# EasyEDA Pro project 学期项目.epro, board PCB2
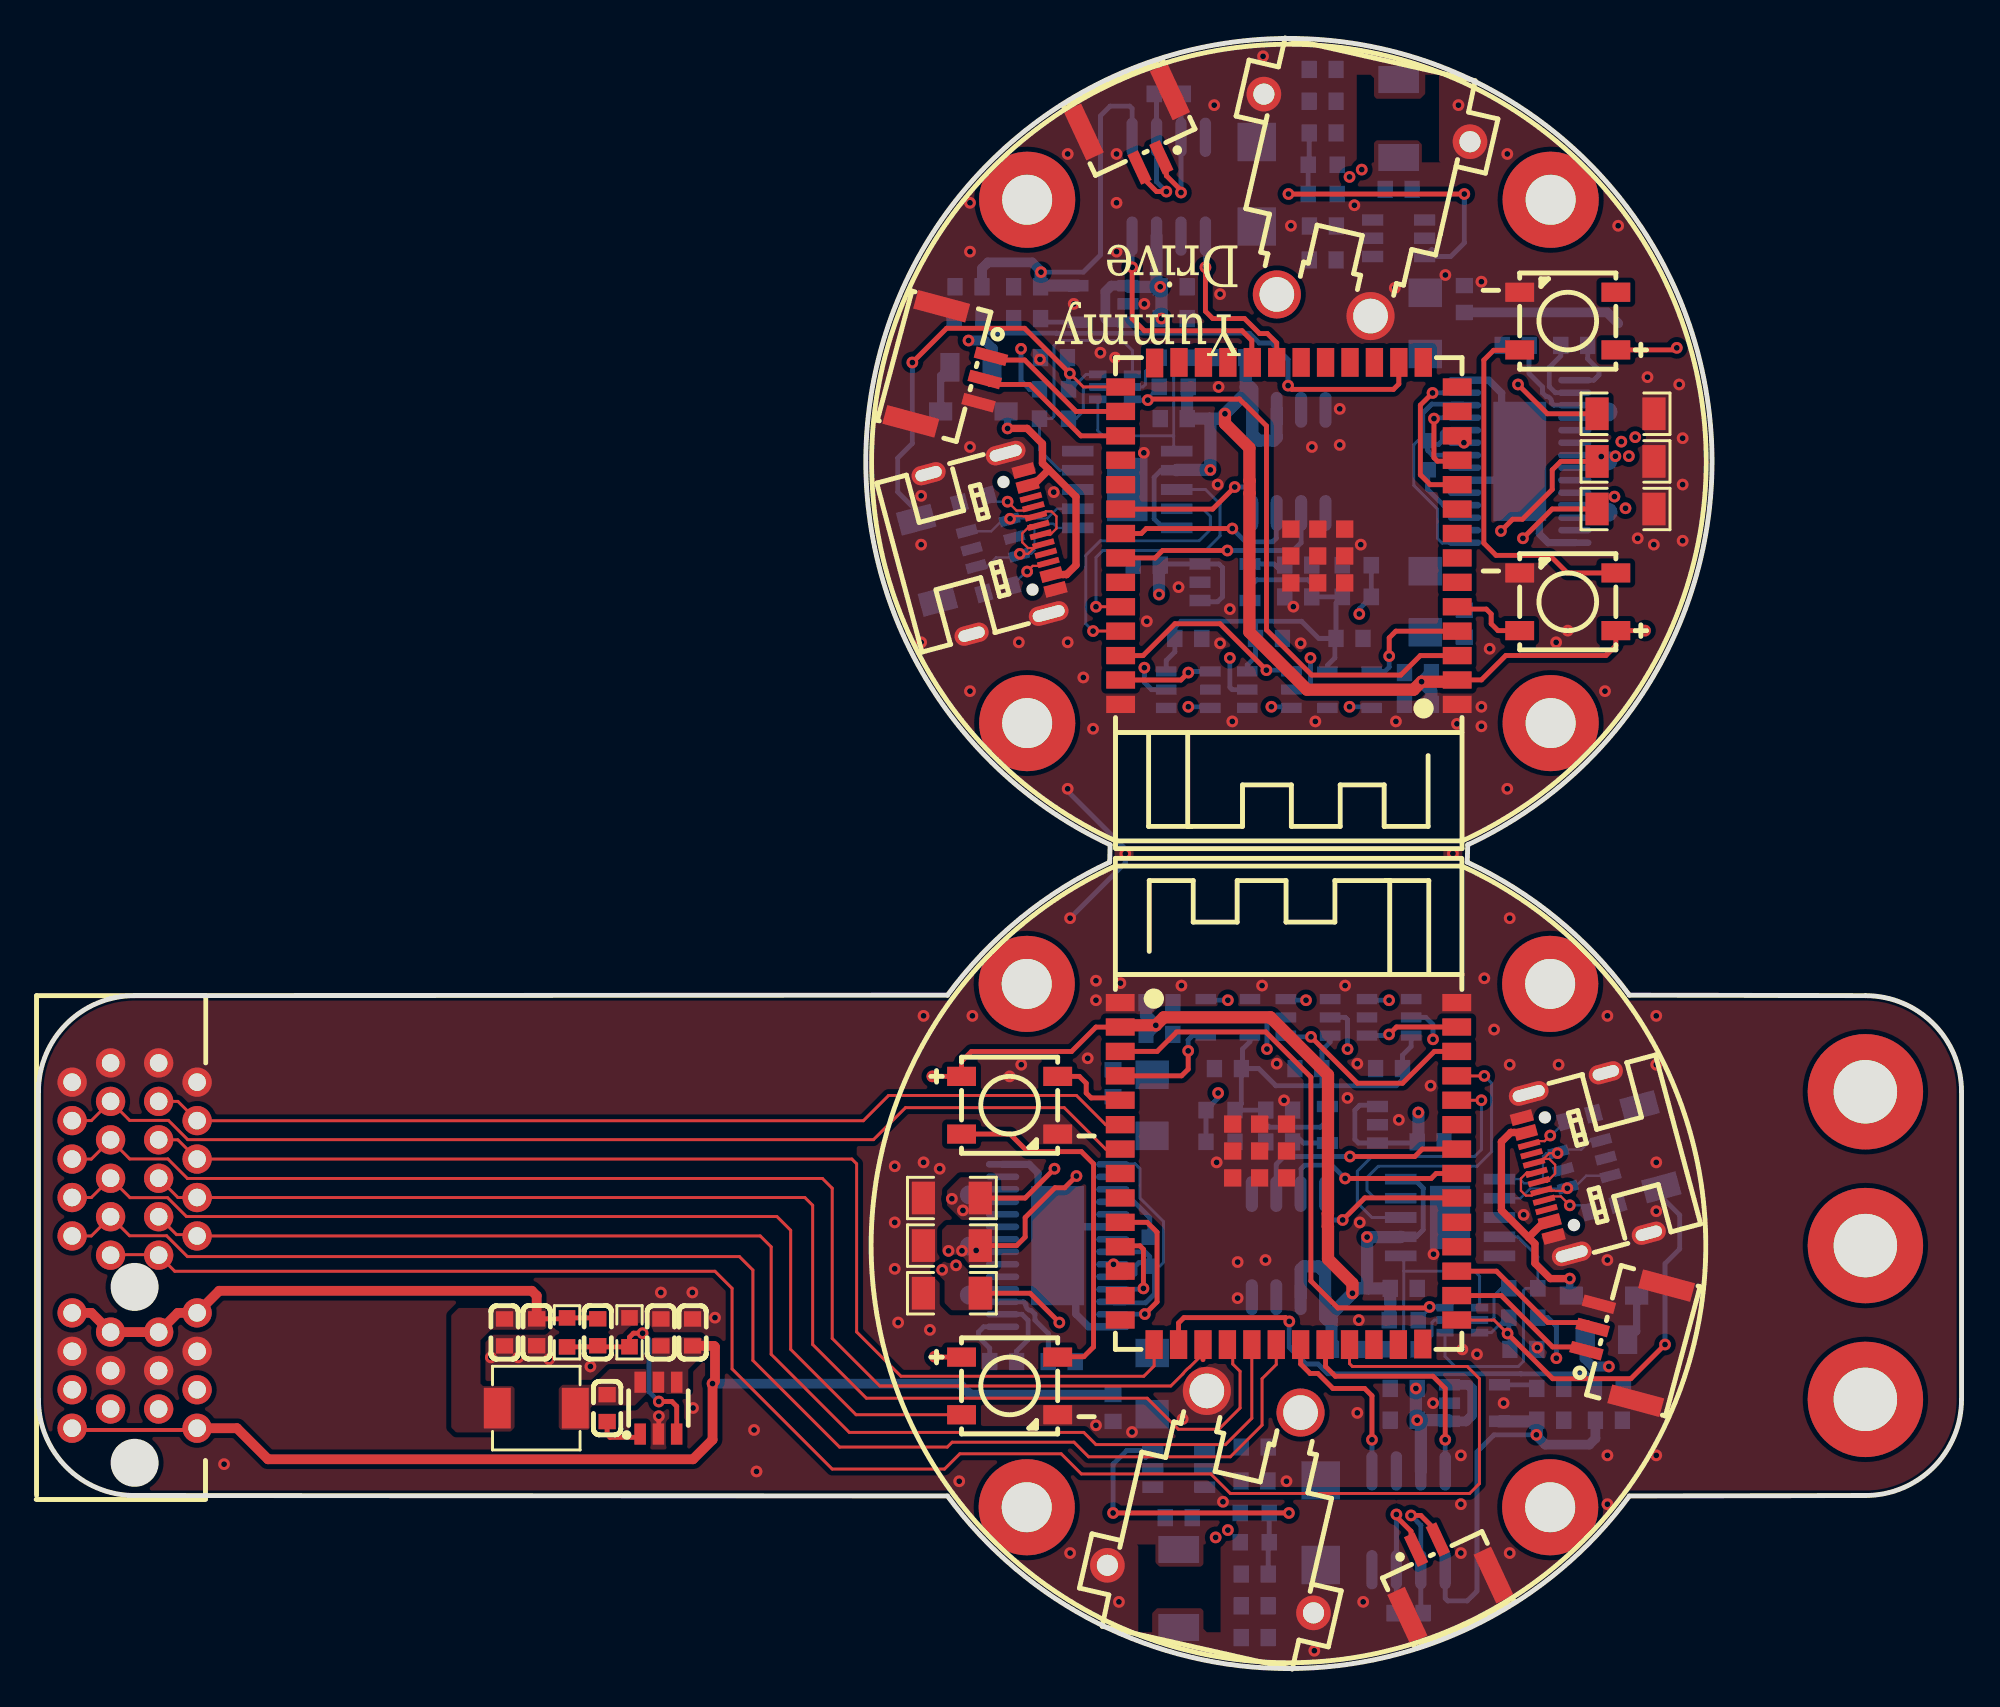
[diagram p17: board, top side]
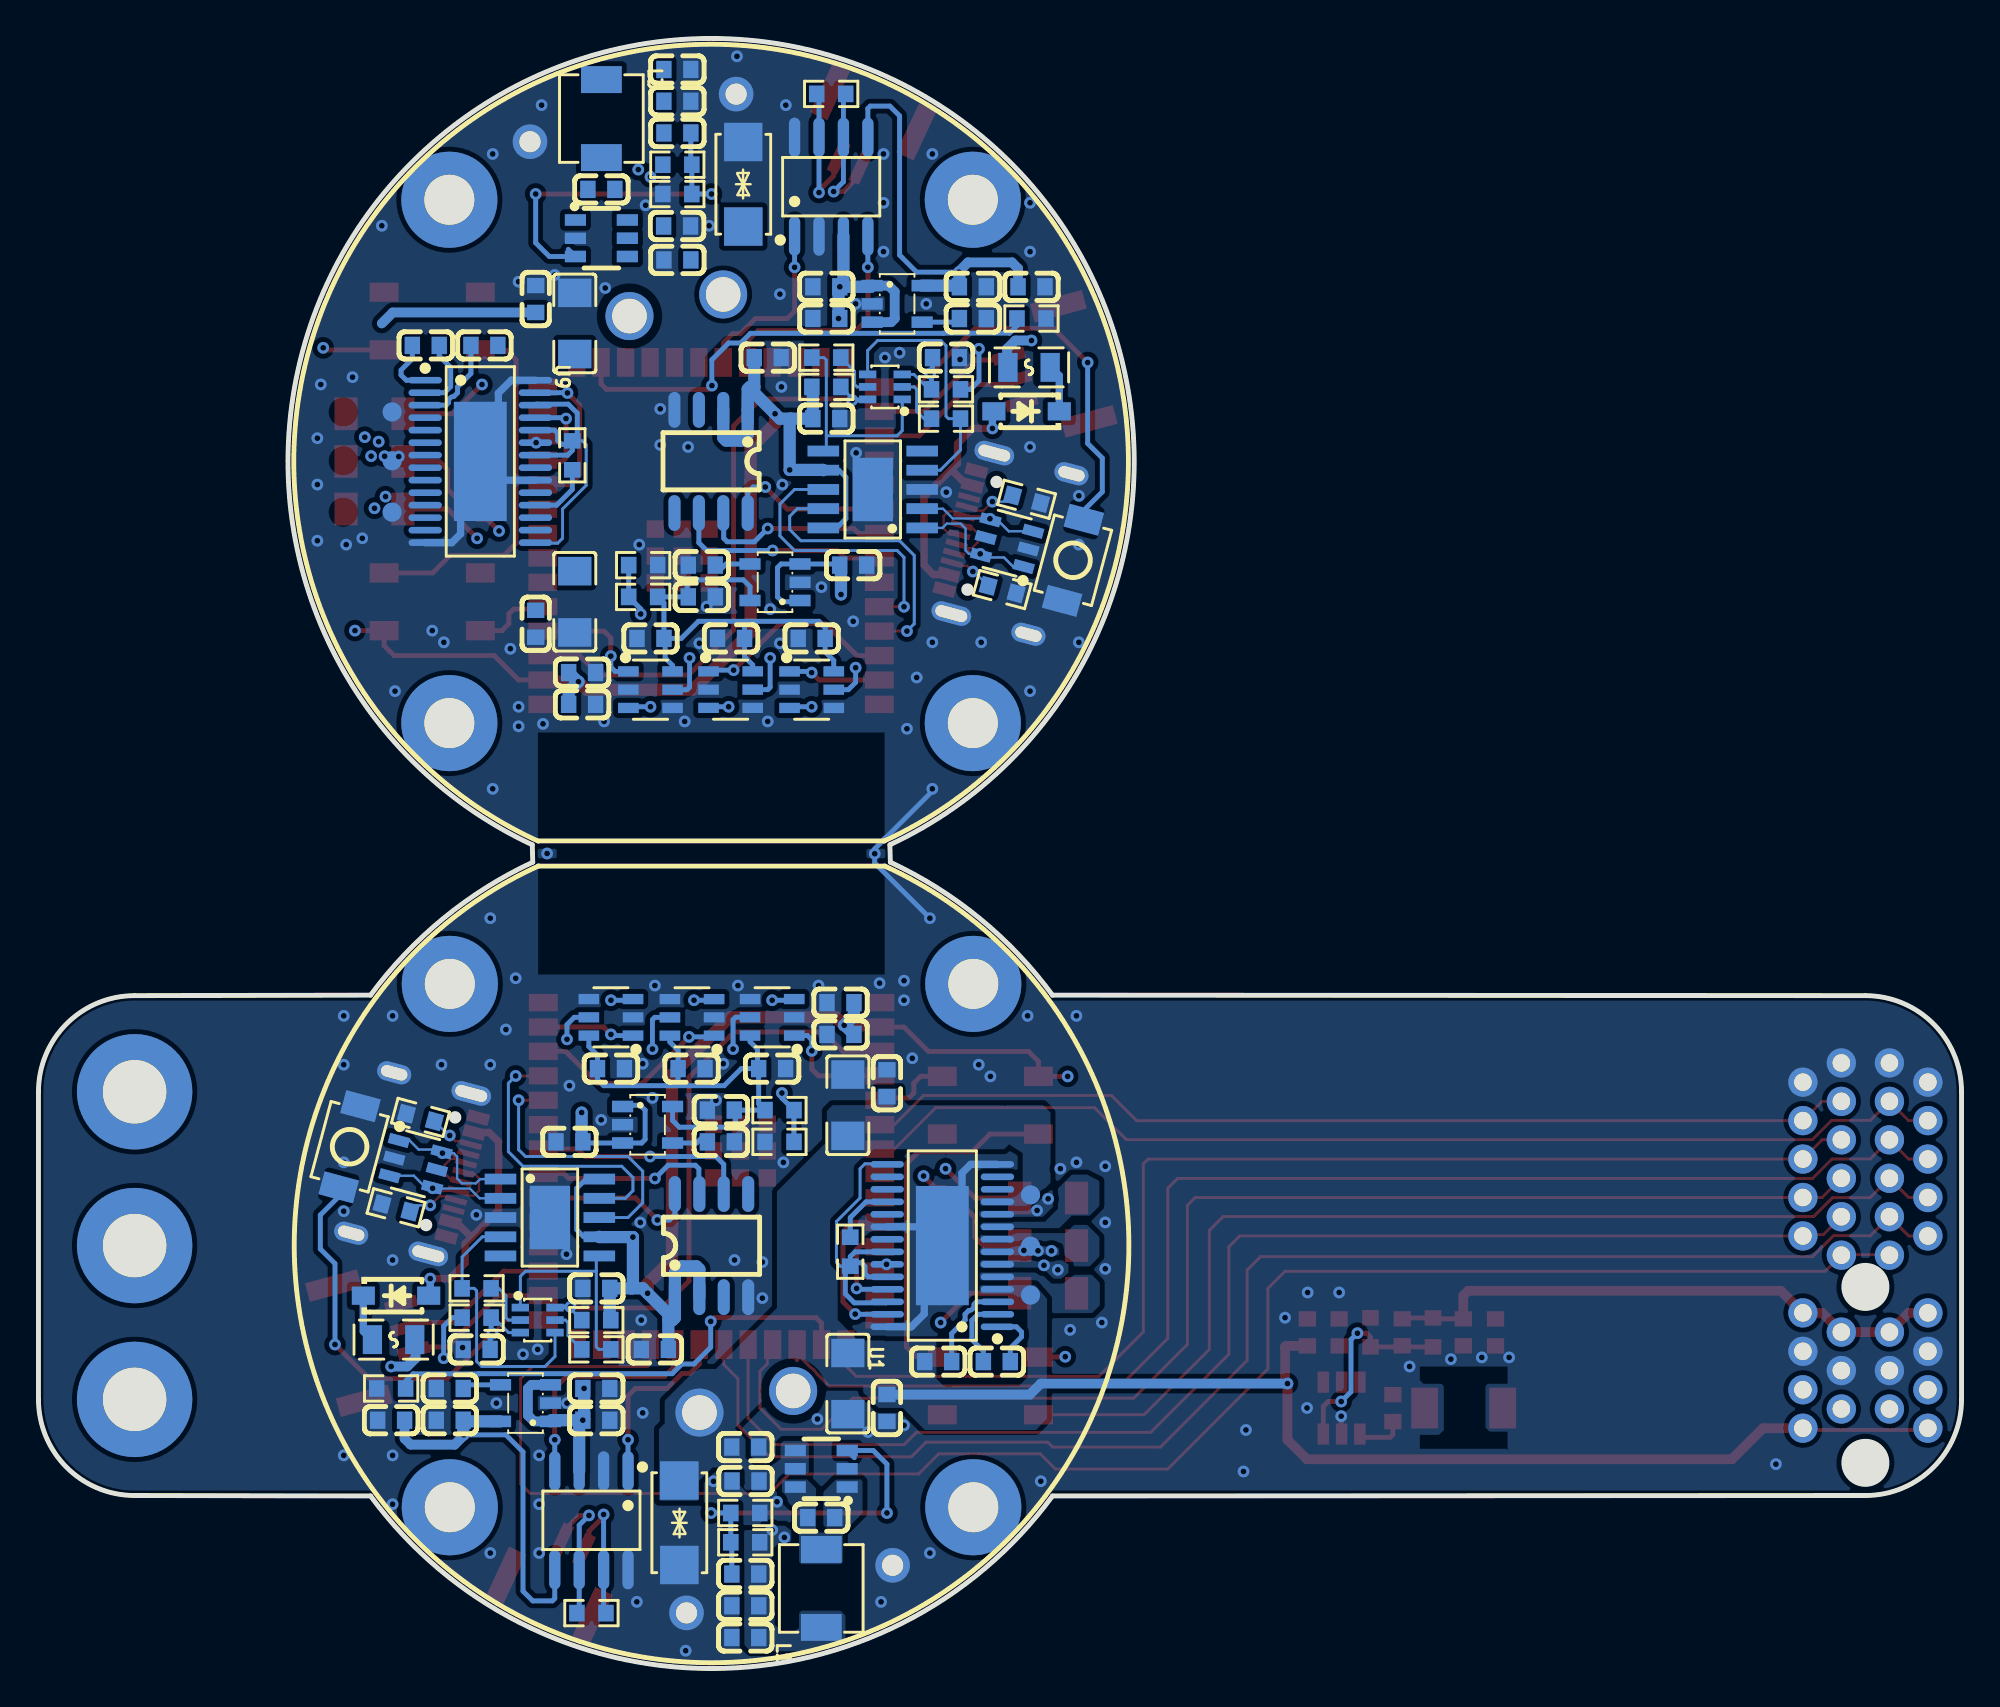
[diagram p18: board, bottom side, seen from below]

Outline 100 x 84.79 mm; copper layers: Top Layer, Inner1, Inner2, Bottom Layer. Coordinates in mm from the lower left corner of the outline.
Outline path: 0,30 arc(1.46,33.54) 5,35 47.27,35.02 arc(51.05,39.01) 55.7,41.94 55.73,42.85 arc(65.02,84.79) 74.32,42.85 74.3,41.94 arc(78.95,39.01) 82.73,35.02 95,35 arc(98.54,33.54) 100,30 100,14 arc(98.54,10.46) 95,9 82.73,8.98 arc(65,0) 47.27,8.98 5,9 arc(1.46,10.46) 0,14 0,30
Stack: Top Layer 0.035mm Outer layer thickness 1oz / Dielectric1 0.2104mm 7628 RC49% 8.6mil / Inner1 0.0152mm Inner layer thickness / Dielectric2 1.065mm 1.1mm H/HOZ Copper / Inner2 0.0152mm Inner layer thickness / Dielectric3 0.2104mm 7628 RC49% 8.6mil / Bottom Layer 0.035mm Outer layer thickness 1oz

## Design rules (mm)
net CANH: DP1
net CANL: DP1
net CH340_D+: DP2
net CH340_D-: DP2
spacing copperThickness1oz (default): track to track 0.102, other pairs 0.152 to 0.3
spacing copperThickness2oz: track to track 0.203, other pairs 0.152 to 0.3
track width copperThickness1oz (default): min 0.102, default 0.254, max 2.54
track width copperThickness2oz: min 0.203, default 0.254, max 2.54
differential pair differentialPair (default): width min 0.102, default 0.254, max 2.54; gap min 0.152, default 0.152
net GND uses copperRegion
net +5V uses copperRegion

## Placement (name value [footprint] x y rotation side)
C1  100nF  [C0603]  24.24 17.48 90 top
C2  100nF  [C0603]  29.57 13.55 270 top
C3  10uF  [C0603]  63.25 3.27 180 bottom
C4  10nF  [C0603]  79.86 68.82 0 bottom
C5  22uF  [C0603]  63.25 11.52 0 bottom
C6  10uF  [C0603]  70.99 12.92 180 bottom
C7  100nF  [C0603]  55.88 13.55 270 bottom
C8  100uF  [C1206]  57.91 29.3 270 bottom
C9  100nF  [C0603]  67.94 16.6 0 bottom
C10  1uF  [C0603]  72.39 27.4 180 bottom
C11  100uF  [C1206]  57.91 14.82 90 bottom
C12  100nF  [C0603]  55.88 30.44 270 bottom
C13  100nF  [C0603]  53.21 15.97 180 bottom
C14  10nF  [C0603]  50.16 15.97 180 bottom
C15  100nF  [C0603]  70.23 31.21 0 bottom
C16  100nF  [C0603]  66.04 31.21 0 bottom
C17  100nF  [C0603]  61.85 31.21 0 bottom
C18  100pF  [C0603]  29.08 17.49 90 top
C19  100nF  [C0603]  70.99 14.57 180 bottom
C20  100nF  [C0603]  63.25 1.61 180 bottom
C21  100nF  [C0603]  59.3 7.85 180 bottom
C22  100pF  [C0603]  63.25 4.92 180 bottom
C23  100nF  [C0603]  63.23 9.76 180 bottom
C24  100nF  [C0603]  64.52 29.05 180 bottom
C25  100nF  [C0603]  76.81 68.82 0 bottom
C26  100nF  [C0603]  64.52 27.4 0 bottom
C27  100nF  [C0603]  32.36 17.48 270 top
C28  10uF  [C0603]  25.91 17.49 90 top
C29  22uF  [C0603]  34.02 17.48 270 top
C30  100nF  [C0603]  74.14 71.23 90 bottom
C31  100nF  [C0603]  74.14 54.34 90 bottom
C32  10uF  [C0603]  71.73 50.15 180 bottom
C33  100nF  [C0603]  71.73 51.8 180 bottom
C34  100uF  [C1206]  72.11 55.49 90 bottom
C35  100uF  [C1206]  72.11 69.96 270 bottom
C36  10uF  [C0603]  58.29 34.63 0 bottom
C37  100nF  [C0603]  58.29 32.98 0 bottom
C38  1uF  [C0603]  77.22 16.6 0 bottom
C39  100nF  [C0603]  78.61 12.92 180 bottom
C40  100nF  [C0603]  81.66 12.92 180 bottom
C41  100nF  [C0603]  70.99 19.78 180 bottom
C42  100nF  [C0603]  70.73 76.94 0 bottom
C43  100nF  [C0603]  78.61 14.57 180 bottom
C44  100nF  [C0603]  68.18 53.58 180 bottom
C45  100nF  [C0603]  66.79 75.03 0 bottom
C46  10uF  [C0603]  66.78 81.52 0 bottom
C47  100pF  [C0603]  66.78 79.87 0 bottom
C48  100nF  [C0603]  66.78 83.17 0 bottom
C49  22uF  [C0603]  66.78 73.27 180 bottom
C50  -  [C0603]  65.51 57.39 180 bottom
C51  -  [C0603]  65.51 55.74 0 bottom
C52  100nF  [C0603]  63.98 53.58 180 bottom
C53  100nF  [C0603]  62.08 68.19 180 bottom
C54  100nF  [C0603]  59.79 53.58 180 bottom
C55  100nF  [C0603]  59.03 65.01 0 bottom
C56  10uF  [C0603]  59.03 71.87 0 bottom
C57  100nF  [C0603]  59.03 70.22 0 bottom
C58  1uF  [C0603]  57.63 57.39 0 bottom
C59  1uF  [C0603]  52.81 68.19 180 bottom
C60  -  [C0603]  51.41 70.22 0 bottom
C61  100nF  [C0603]  51.41 71.87 0 bottom
C62  -  [C0603]  48.36 71.87 0 bottom
CN1  WAFER-GH1.25-3PWB  [CONN-TH_3P-P1.25_GH1.25]  82.34 17.33 75 top
CN2  XT30PW-M30.G.Y  [CONN-TH_XT30PW-M]  62.07 9 347 top
CN3  WAFER-GH1.25-2PWB  [CONN-TH_2P-P1.25_XUNPU_WAFER-GH1.25-2PWB]  72.81 5.13 25 top
CN4  3183-10110P1T  [CONN-TH_36P-P1.00-V_3183-XXXXXPXT]  5 22 270 top
CN5  XT30PW-M30.G.Y  [CONN-TH_XT30PW-M]  67.96 75.78 167 top
CN6  WAFER-GH1.25-2PWB  [CONN-TH_2P-P1.25_XUNPU_WAFER-GH1.25-2PWB]  57.21 79.65 205 top
CN7  WAFER-GH1.25-3PWB  [CONN-TH_3P-P1.25_GH1.25]  47.69 67.46 255 top
D1  SMAJ40CA  [SMA_L4.3-W2.6-LS5.0-BI]  66.68 7.58 90 bottom
D2  USBLC6-2SC6  [SOT-23-6_L2.9-W1.6-P0.95-LS2.8-BL]  80.39 26.25 285 bottom
D3  B5819W SL  [SOD-123_L2.7-W1.6-LS3.7-RD-1]  81.41 19.39 180 bottom
D4  SMAJ40CA  [SMA_L4.3-W2.6-LS5.0-BI]  63.35 77.2 270 bottom
D5  USBLC6-2SC6  [SOT-23-6_L2.9-W1.6-P0.95-LS2.8-BL]  49.63 58.53 105 bottom
D6  B5819W SL  [SOD-123_L2.7-W1.6-LS3.7-RD-1]  48.62 65.39 0 bottom
F1  JK-SMD0805-100  [F0805]  81.53 17.11 180 bottom
F2  JK-SMD0805-100  [F0805]  48.49 67.68 0 bottom
L1  10uH  [IND-SMD_L4.4-W4.2]  59.3 4.17 90 bottom
L2  10uH  [IND-SMD_L4.4-W4.2]  25.89 13.55 0 top
L3  10uH  [IND-SMD_L4.4-W4.2]  70.73 80.62 270 bottom
LED1  XL-5050RGBC-WS2812B  [LED-SMD_4P-L5.0-W5.0-BL_XL-5050RGBC]  50.5 14.7 270 top
LED2  XL-5050RGBC-WS2812B  [LED-SMD_4P-L5.0-W5.0-BL_XL-5050RGBC]  50.5 29.3 270 top
LED3  XL-5050RGBC-WS2812B  [LED-SMD_4P-L5.0-W5.0-BL_XL-5050RGBC]  79.52 55.49 90 top
LED4  XL-5050RGBC-WS2812B  [LED-SMD_4P-L5.0-W5.0-BL_XL-5050RGBC]  79.52 70.09 90 top
MARK1  -  [Mark-Point-1mm]  45.87 19.42 180 bottom
MARK2  -  [Mark-Point-1mm]  45.87 21.97 180 bottom
MARK3  -  [Mark-Point-1mm]  45.87 24.64 180 bottom
MARK4  -  [Mark-Point-1mm]  84.15 62.82 0 bottom
MARK5  -  [Mark-Point-1mm]  84.15 60.15 0 bottom
MARK6  -  [Mark-Point-1mm]  84.15 65.36 0 bottom
NOREF  -  [Pad_e237]  51.39 35.61 0 top
NOREF#2  -  [Pad_e239]  51.39 8.39 0 top
NOREF#3  -  [Pad_e1785]  51.41 49.18 180 top
NOREF#4  -  [Pad_e813]  95 30 0 top
NOREF#5  -  [Pad_e240]  78.61 8.39 0 top
NOREF#6  -  [Pad_e1784]  78.63 76.4 180 top
NOREF#7  -  [Pad_e1786]  51.41 76.4 180 top
NOREF#8  -  [Pad_e815]  95 14 0 top
NOREF#9  -  [Pad_e1783]  78.63 49.18 180 top
NOREF#10  -  [Pad_e238]  78.61 35.61 0 top
NOREF#11  -  [Pad_e814]  95 22 0 top
Q1  LMBT3904DW1T1G  [SOT-363_L2.0-W1.3-P0.65-LS2.1-BR]  55.98 66.66 180 bottom
Q2  LMBT3904DW1T1G  [SOT-363_L2.0-W1.3-P0.65-LS2.1-BR]  74.04 18.12 0 bottom
R1  120  [R0603]  71.25 2.88 180 bottom
R2  10K  [R0603]  57.78 21.68 270 bottom
R3  1K  [R0603]  61.47 29.05 0 bottom
R4  1K  [R0603]  61.47 27.4 180 bottom
R5  22K  [R0603]  63.25 6.57 180 bottom
R6  3K  [R0603]  63.25 8.09 0 bottom
R7  50mΩ  [R1206]  47.5 24.47 180 top
R8  50mΩ  [R1206]  47.5 22 180 top
R9  50mΩ  [R1206]  47.5 19.52 180 top
R10  5.1K  [R0603]  81.41 23.97 195 bottom
R11  5.1K  [R0603]  80.14 28.67 195 bottom
R12  43K  [R0603]  27.49 17.48 90 top
R13  10K  [R0603]  30.73 17.49 270 top
R14  10K  [R0603]  72.24 63.11 90 bottom
R15  1K  [R0603]  68.56 55.74 180 bottom
R16  1K  [R0603]  68.56 57.39 0 bottom
R17  10kΩ  [R0603]  77.22 18.25 180 bottom
R18  10kΩ  [R0603]  70.99 18.12 0 bottom
R19  10kΩ  [R0603]  81.66 14.57 180 bottom
R20  3K  [R0603]  66.78 76.69 180 bottom
R21  22K  [R0603]  66.78 78.22 0 bottom
R22  10kΩ  [R0603]  77.22 19.78 0 bottom
R23  10kΩ  [R0603]  70.99 16.6 180 bottom
R24  10kΩ  [R0603]  59.03 68.19 0 bottom
R25  10kΩ  [R0603]  59.03 66.66 180 bottom
R26  120  [R0603]  58.78 81.9 0 bottom
R27  10kΩ  [R0603]  52.81 66.53 0 bottom
R28  10kΩ  [R0603]  52.81 65.01 180 bottom
R29  5.1K  [R0603]  49.89 56.12 15 bottom
R30  5.1K  [R0603]  48.62 60.82 15 bottom
R31  10kΩ  [R0603]  48.36 70.22 0 bottom
R32  50mΩ  [R1206]  82.53 60.31 0 top
R33  50mΩ  [R1206]  82.53 65.26 0 top
R34  50mΩ  [R1206]  82.53 62.79 0 top
SW1  TS-1088-AR02016  [SW-SMD_L3.9-W3.0-P4.45]  46.2 57.64 285 bottom
SW6  TS-1088-AR02016  [SW-SMD_L3.9-W3.0-P4.45]  83.82 27.14 105 bottom
U1  DRV8313PWPR  [HTSSOP-28_L9.8-W4.5-P0.65-LS6.6-BL-EP]  53 22 90 bottom
U2  INA181A2IDBVR  [SOT-23-6_L2.9-W1.6-P0.95-LS2.8-BL]  70.23 33.87 90 bottom
U3  INA181A2IDBVR  [SOT-23-6_L2.9-W1.6-P0.95-LS2.8-BL]  66.02 33.87 90 bottom
U4  INA181A2IDBVR  [SOT-23-6_L2.9-W1.6-P0.95-LS2.8-BL]  61.85 33.87 90 bottom
U5  TJA1051T/3/1J  [SOIC-8_L4.9-W3.9-P1.27-LS6.0-BL]  71.25 7.71 0 bottom
U6  RS3236-3.3AYF5  [SOT-23-5_L3.0-W1.7-P0.95-LS2.8-BR]  68.33 28.28 0 bottom
U7  ME3121AM6G  [SOT-23-6_L2.9-W1.6-P0.95-LS2.8-BR]  59.3 10.39 180 bottom
U8  ME3121AM6G  [SOT-23-6_L2.9-W1.6-P0.95-LS2.8-BR]  32.24 13.55 270 top
U9  DRV8313PWPR  [HTSSOP-28_L9.8-W4.5-P0.65-LS6.6-BL-EP]  77.02 62.79 270 bottom
U10  MT6701CT-STD  [SOP-8_L4.9-W3.9-P1.27-LS6.0-BL]  65 22 180 bottom
U11  ME3121AM6G  [SOT-23-6_L2.9-W1.6-P0.95-LS2.8-BR]  70.73 74.4 0 bottom
U12  INA181A2IDBVR  [SOT-23-6_L2.9-W1.6-P0.95-LS2.8-BL]  68.18 50.91 270 bottom
U13  MT6701CT-STD  [SOP-8_L4.9-W3.9-P1.27-LS6.0-BL]  65.02 62.79 0 bottom
U14  INA181A2IDBVR  [SOT-23-6_L2.9-W1.6-P0.95-LS2.8-BL]  64.01 50.92 270 bottom
U15  RS3236-3.3AYF5  [SOT-23-5_L3.0-W1.7-P0.95-LS2.8-BR]  61.7 56.5 180 bottom
U16  INA181A2IDBVR  [SOT-23-6_L2.9-W1.6-P0.95-LS2.8-BL]  59.79 50.91 270 bottom
U17  TJA1051T/3/1J  [SOIC-8_L4.9-W3.9-P1.27-LS6.0-BL]  58.78 77.08 180 bottom
U18  CH340K  [ESOP-10_L4.9-W3.9-P1.00-LS6.0-BL-EP]  56.62 61.33 90 bottom
U19  RS3236-3.3AYF5  [SOT-23-5_L3.0-W1.7-P0.95-LS2.8-BR]  74.67 13.81 180 bottom
U20  RS3236-3.3AYF5  [SOT-23-5_L3.0-W1.7-P0.95-LS2.8-BR]  55.35 70.98 0 bottom
U21  ESP32-S3-WROOM-1-N16R8  [WIRELM-SMD_ESP32-S3-WROOM-1]  65 25.74 0 top
U22  CH340K  [ESOP-10_L4.9-W3.9-P1.00-LS6.0-BL-EP]  73.41 23.46 270 bottom
U23  ESP32-S3-WROOM-1-N16R8  [WIRELM-SMD_ESP32-S3-WROOM-1]  65.02 59.04 180 top
USB1  TYPEC-304-ACP16  [USB-C-SMD_TYPE-C-16P-1_1]  49.73 58.6 285 top
USB2  TYPEC-304-ACP16  [USB-C-SMD_TYPE-C-16P-1_1]  80.29 26.19 105 top

## Footprints (pads in the part's own frame, mm; a bottom-side part is the same pattern mirrored in y, then rotated)
C0603
  rect 0.8x0.9 smd: 1(-0.7,0) 2(0.7,0)
C1206
  rect 1.485x1.728 smd: 1(-1.593,0) 2(1.593,0)
CONN-TH_2P-P1.25_XUNPU_WAFER-GH1.25-2PWB
  rect 0.6x1.7 smd: 1(-0.625,1.45) 2(0.625,1.45)
  rect 1x2.8 smd: 3(-2.475,-1.45) 4(2.475,-1.45)
CONN-TH_3P-P1.25_GH1.25
  rect 0.6x1.7 smd: 1(-1.25,1.575) 2(0,1.575) 3(1.25,1.575)
  rect 1x2.8 smd: 4(3.1,-1.575) 5(-3.1,-1.575)
CONN-TH_36P-P1.00-V_3183-XXXXXPXT
  round 1.524 hole 0.914: A1(-9.5,1.25) A2(-8.5,3.25) A3(-7.5,1.25) A4(-6.5,3.25) A5(-5.5,1.25) A6(-4.5,3.25) A7(-3.5,1.25) A8(-2.5,3.25) A9(-1.5,1.25) A10(-0.5,3.25) A11(0.5,1.25) A12(3.5,3.25) A13(4.5,1.25) A14(5.5,3.25) A15(6.5,1.25) A16(7.5,3.25) A17(8.5,1.25) A18(9.5,3.25) B1(-9.5,-1.25) B2(-8.5,-3.25) B3(-7.5,-1.25) B4(-6.5,-3.25) B5(-5.5,-1.25) B6(-4.5,-3.25) B7(-3.5,-1.25) B8(-2.5,-3.25) B9(-1.5,-1.25) B10(-0.5,-3.25) B11(0.5,-1.25) B12(3.5,-3.25) B13(4.5,-1.25) B14(5.5,-3.25) B15(6.5,-1.25) B16(7.5,-3.25) B17(8.5,-1.25) B18(9.5,-3.25)
CONN-TH_XT30PW-M
  round 2.5 hole 1.8: 1(-2.5,5) 2(2.5,5)
  round 1.8 hole 1.1: 3(5.5,-5) 4(-5.5,-5)
ESOP-10_L4.9-W3.9-P1.00-LS6.0-BL-EP
  rect 0.56x1.64 smd: 1(-2,-2.57) 2(-1,-2.57) 3(0,-2.57) 4(1,-2.57) 5(2,-2.57) 6(2,2.57) 7(1,2.57) 8(0,2.57) 9(-1,2.57) 10(-2,2.57)
  rect 3.3x2.1 smd: 11(0,0)
F0805
  rect 1x1.5 smd: 1(-1.1,0) 2(1.1,0)
HTSSOP-28_L9.8-W4.5-P0.65-LS6.6-BL-EP
  oval 0.343x1.732 smd: 1(-4.225,-2.866) 2(-3.575,-2.866) 3(-2.925,-2.866) 4(-2.275,-2.866) 5(-1.625,-2.866) 6(-0.975,-2.866) 7(-0.325,-2.866) 8(0.325,-2.866) 9(0.975,-2.866) 10(1.625,-2.866) 11(2.275,-2.866) 12(2.925,-2.866) 13(3.575,-2.866) 14(4.225,-2.866) 15(4.225,2.866) 16(3.575,2.866) 17(2.925,2.866) 18(2.275,2.866) 19(1.625,2.866) 20(0.975,2.866) 21(0.325,2.866) 22(-0.325,2.866) 23(-0.975,2.866) 24(-1.625,2.866) 25(-2.275,2.866) 26(-2.925,2.866) 27(-3.575,2.866) 28(-4.225,2.866)
  rect 6.2x2.75 smd: 29(0,0)
IND-SMD_L4.4-W4.2
  rect 1.4x2.12 smd: 1(2.028,0) 2(-2.028,0)
LED-SMD_4P-L5.0-W5.0-BL_XL-5050RGBC
  rect 1x1.5 smd: 1(-1.5,-2.5) 2(1.5,-2.5) 3(1.5,2.5) 4(-1.5,2.5)
Mark-Point-1mm
  round 1 smd: 1(-2.54,0)
Pad_e237
  round 5 hole 2.6: 1(0,0)
Pad_e238
  round 5 hole 2.6: 1(0,0)
Pad_e239
  round 5 hole 2.6: 1(0,0)
Pad_e240
  round 5 hole 2.6: 1(0,0)
Pad_e813
  round 6 hole 3.3: 1(0,0)
Pad_e814
  round 6 hole 3.3: 1(0,0)
Pad_e815
  round 6 hole 3.3: 1(0,0)
Pad_e1783
  round 5 hole 2.6: 1(0,0)
Pad_e1784
  round 5 hole 2.6: 1(0,0)
Pad_e1785
  round 5 hole 2.6: 1(0,0)
Pad_e1786
  round 5 hole 2.6: 1(0,0)
R0603
  rect 0.806x0.864 smd: 1(-0.753,0) 2(0.753,0)
R1206
  rect 1.208x1.701 smd: 1(-1.479,0) 2(1.479,0)
SMA_L4.3-W2.6-LS5.0-BI
  rect 2x2 smd: 1(-2.2,0) 2(2.2,0)
SOD-123_L2.7-W1.6-LS3.7-RD-1
  rect 1.2x0.95 smd: 1(-1.7,0) 2(1.7,0)
SOIC-8_L4.9-W3.9-P1.27-LS6.0-BL
  oval 0.588x2.045 smd: 1(-1.905,-2.57) 2(-0.635,-2.57) 3(0.635,-2.57) 4(1.905,-2.57) 5(1.905,2.57) 6(0.635,2.57) 7(-0.635,2.57) 8(-1.905,2.57)
SOP-8_L4.9-W3.9-P1.27-LS6.0-BL
  oval 0.63x1.865 smd: 1(-1.905,-2.683) 2(-0.635,-2.683) 3(0.635,-2.683) 4(1.905,-2.683) 5(1.905,2.683) 6(0.635,2.683) 7(-0.635,2.683) 8(-1.905,2.683)
SOT-23-5_L3.0-W1.7-P0.95-LS2.8-BR
  rect 1.1x0.6 smd: 1(1.3,-0.95) 2(1.3,0) 3(1.3,0.95) 4(-1.3,0.95) 5(-1.3,-0.95)
SOT-23-6_L2.9-W1.6-P0.95-LS2.8-BL
  rect 0.532x1.072 smd: 1(-0.95,-1.149) 2(0,-1.149) 3(0.95,-1.149) 4(0.95,1.149) 5(0,1.149) 6(-0.95,1.149)
SOT-23-6_L2.9-W1.6-P0.95-LS2.8-BR
  rect 1.1x0.6 smd: 1(1.35,-0.95) 2(1.35,0) 3(1.35,0.95) 4(-1.35,0.95) 5(-1.35,0) 6(-1.35,-0.95)
SOT-363_L2.0-W1.3-P0.65-LS2.1-BR
  rect 0.9x0.4 smd: 1(0.9,-0.65) 2(0.9,0) 3(0.9,0.65) 4(-0.9,0.65) 5(-0.9,0) 6(-0.9,-0.65)
SW-SMD_L3.9-W3.0-P4.45
  rect 1.23x1.86 smd: 1(-2.185,0) 2(2.185,0)
USB-C-SMD_TYPE-C-16P-1_1
  rect 0.6x1.15 smd: A1B12(-3.2,2.41) A4B9(-2.4,2.41) B1A12(3.2,2.41) B4A9(2.4,2.41)
  rect 0.3x1.15 smd: A5(-1.25,2.41) A6(-0.25,2.41) A7(0.25,2.41) A8(1.25,2.41) B5(1.75,2.41) B6(0.75,2.41) B7(-0.75,2.41) B8(-1.75,2.41)
  oval 1x2.1 hole 0.6x1.7: EP(-4.32,1.74) EP(4.32,1.74)
  oval 1x1.8 hole 0.6x1.4: EP(-4.32,-2.41) EP(4.32,-2.41)
WIRELM-SMD_ESP32-S3-WROOM-1
  rect 1.5x0.9 smd: 1(-8.75,8.895) 2(-8.75,7.625) 3(-8.75,6.355) 4(-8.75,5.085) 5(-8.75,3.815) 6(-8.75,2.545) 7(-8.75,1.275) 8(-8.75,0.005) 9(-8.75,-1.265) 10(-8.75,-2.535) 11(-8.75,-3.805) 12(-8.75,-5.075) 13(-8.75,-6.345) 14(-8.75,-7.615) 27(8.75,-7.615) 28(8.75,-6.345) 29(8.75,-5.075) 30(8.75,-3.805) 31(8.75,-2.535) 32(8.75,-1.265) 33(8.75,0.005) 34(8.75,1.275) 35(8.75,2.545) 36(8.75,3.815) 37(8.75,5.085) 38(8.75,6.355) 39(8.75,7.625) 40(8.75,8.895)
  rect 0.9x1.5 smd: 15(-6.985,-8.895) 16(-5.715,-8.895) 17(-4.445,-8.895) 18(-3.175,-8.895) 19(-1.905,-8.895) 20(-0.635,-8.895) 21(0.635,-8.895) 22(1.905,-8.895) 23(3.175,-8.895) 24(4.445,-8.895) 25(5.715,-8.895) 26(6.985,-8.865)
  rect 0.9x0.9 smd: 41(-2.9,2.575) 41(-2.9,1.175) 41(-2.9,-0.225) 41(-1.5,2.575) 41(-1.5,1.175) 41(-1.5,-0.225) 41(-0.1,2.575) 41(-0.1,1.175) 41(-0.1,-0.225)

## Nets
+5V: C3.2 C6.1 C10.2 C19.1 C20.2 C22.2 C46.2 C47.2 C48.2 C56.1 C57.1 C58.2 L1.2 L3.2 R5.2 R21.2 U5.3 U6.1 U6.3 U15.1 U15.3 U17.3 U19.1 U19.3 U20.1 U20.3
AVCC: C15.2 C16.2 C17.2 C24.2 C44.2 C51.2 C52.2 C54.2 R3.2 R15.2 U2.6 U3.6 U4.6 U6.5 U12.6 U14.6 U15.5 U16.6
GND: C1.1 C3.1 C5.1 C6.2 C7.2 C8.1 C9.2 C10.1 C11.1 C12.1 C15.1 C16.1 C17.1 C19.2 C20.1 C23.1 C24.1 C26.1 C27.1 C28.1 C29.1 C30.2 C31.1 C32.2 C33.2 C34.1 C35.1 C36.2 C37.2 C38.2 C39.1 C40.1 C41.1 C43.1 C44.1 C45.1 C46.1 C48.1 C49.1 C50.1 C51.1 C52.1 C53.2 C54.1 C55.1 C56.2 C57.2 C58.1 C59.2 C60.1 C61.1 C62.1 CN1.3 CN1.4 CN1.5 CN2.1 CN2.3 CN2.4 CN3.3 CN3.4 CN4.A1 CN4.A2 CN4.A14 CN4.A15 CN4.B1 CN4.B2 CN4.B14 CN4.B15 CN5.1 CN5.3 CN5.4 CN6.3 CN6.4 CN7.3 CN7.4 CN7.5 D1.1 D2.2 D4.1 D5.2 LED1.3 LED2.3 LED3.3 LED4.3 R4.1 R6.1 R7.2 R8.2 R9.2 R10.1 R11.1 R13.1 R16.1 R19.1 R20.1 R29.1 R30.1 R31.1 R32.2 R33.2 R34.2 SW1.2 SW6.2 U1.14 U1.20 U1.28 U1.29 U2.2 U2.4 U3.2 U3.4 U4.2 U4.4 U5.2 U5.8 U6.2 U7.2 U8.2 U9.14 U9.20 U9.28 U9.29 U10.4 U11.2 U12.2 U12.4 U13.4 U14.2 U14.4 U15.2 U16.2 U16.4 U17.2 U17.8 U18.3 U18.11 U19.2 U20.2 U21.1 U21.40 U21.41 U22.3 U22.11 U23.1 U23.40 U23.41 USB1.A1B12 USB1.B1A12 USB1.EP USB2.A1B12 USB2.B1A12 USB2.EP
PVCC: C5.2 C7.1 C8.2 C11.2 C12.2 C13.1 C23.2 C25.1 C27.2 C29.2 C30.1 C31.2 C34.2 C35.2 C45.2 C49.2 CN2.2 CN4.A18 CN4.B18 CN5.2 D1.2 D4.2 U1.4 U1.11 U7.4 U7.5 U8.4 U8.5 U9.4 U9.11 U11.4 U11.5
VBUS: D3.2 D6.2 USB1.A4B9 USB1.B4A9 USB2.A4B9 USB2.B4A9
VCC: C9.1 C32.1 C33.1 C36.1 C37.1 C39.2 C40.2 C41.2 C53.1 C55.2 C61.2 C62.2 LED1.1 LED2.1 LED3.1 LED4.1 R17.1 R18.1 R25.1 R27.1 U5.5 U10.1 U10.2 U13.1 U13.2 U17.5 U18.7 U18.10 U19.5 U20.5 U21.2 U22.7 U22.10 U23.2
CAN_RX: U5.4 U17.4 U21.22 U23.22
CAN_TX: U5.1 U17.1 U21.21 U23.21
CANH: CN3.1 CN6.1 R1.2 R26.2 U5.7 U17.7
CANL: CN3.2 CN6.2 R1.1 R26.1 U5.6 U17.6
CH340_D+: D2.1 D2.6 D5.1 D5.6 U18.1 U22.1 USB1.A6 USB1.B6 USB2.A6 USB2.B6
CH340_D-: D2.3 D2.4 D5.3 D5.4 U18.2 U22.2 USB1.A7 USB1.B7 USB2.A7 USB2.B7
CUR_A: U2.1 U16.1 U21.39 U23.39
CUR_B: U3.1 U14.1 U21.38 U23.38
CUR_C: U4.1 U12.1 U21.4 U23.4
DTR: Q1.4 Q2.4 R22.2 R28.2 U18.4 U22.4
INA: U1.27 U9.27 U21.10 U23.10
INB: U1.25 U9.25 U21.11 U23.11
INC: U1.23 U9.23 U21.12 U23.12
IO0_BOOT: C38.1 C59.1 Q1.3 Q2.3 R17.2 R27.2 SW1.1 SW6.1 U21.27 U23.27
IO3_DVP_VSYNC: CN4.A5 CN4.A6 U21.15 U23.15
IO5_DVP_XCLK: LED2.4 LED3.4 U21.5 U23.5
IO6_DVP_D5: CN4.A3 CN4.A4 U21.6 U23.6
IO7_DVP_PCLK: CN4.B3 CN4.B4 U21.7 U23.7
IO9_DVP_D7: CN4.B5 CN4.B6 U21.17 U23.17
IO10: CN4.A7 CN4.A8 U21.18 U23.18
IO11: CN4.A9 CN4.A10 U21.19 U23.19
IO12_I2S_DI: CN4.B9 CN4.B10 U21.20 U23.20
IO15_DVP_D4: U21.8 U23.8
IO16_DVP_D0: U21.9 U23.9
IO19_USB_D-: U21.13 U23.13
IO20_USB_D+: U21.14 U23.14
IO21_SD_DAT0: CN4.A11 CN4.B11 U21.23 U23.23
IO35: CN1.1 CN7.1 U21.28 U23.28
IO36: CN1.2 CN7.2 U21.29 U23.29
IO37: U21.30 U23.30
IO38_I2S_MCK: U21.31 U23.31
IO39_LCD_DC: U10.8 U13.8 U21.32 U23.32
IO40_LCD_MOSI: U10.7 U13.7 U21.33 U23.33
IO41_LCD_SCK: U10.6 U13.6 U21.34 U23.34
IO42_LCD_BL: U21.35 U23.35
IO45_I2S_DO: U21.26 U23.26
IO46_DVP_HREF: R19.2 R31.2 U21.16 U23.16
IO47_SD_CLK: U21.24 U23.24
IO48_SD_CMD: U21.25 U23.25
LIGHTVCC: C1.2 C18.2 C28.2 CN4.A12 CN4.A13 CN4.B12 CN4.B13 L2.2 R12.2
ME3121_FB: C22.1 C47.1 R5.1 R6.2 R20.2 R21.1 U7.3 U11.3
ME3121_FB2: C18.1 R12.1 R13.2 U8.3
NFAULT: R2.1 R14.1 U1.18 U9.18
NRESET: U1.16 U9.16
NSLEEP: U1.17 U9.17
OUT1: U1.5 U9.5
OUT2: U1.8 U9.8
OUT3: U1.9 U9.9
REF: R3.1 R4.2 R15.1 R16.2 U2.5 U3.5 U4.5 U12.5 U14.5 U16.5
RESET: Q1.6 Q2.6 R18.2 R25.2 U21.3 U23.3
RTS: Q1.1 Q2.1 R23.2 R24.2 U18.6 U22.6
SP1: R9.1 R33.1 U1.6 U2.3 U9.6 U16.3
SP2: R8.1 R34.1 U1.7 U3.3 U9.7 U14.3
SP3: R7.1 R32.1 U1.10 U4.3 U9.10 U12.3
U0RXD: U18.8 U21.36 U22.8 U23.36
U0TXD: U18.9 U21.37 U22.9 U23.37
USB5V: D2.5 D5.5
WS2812_OUTPUT: CN4.B7 CN4.B8 LED1.2 LED4.2
$1N93: C21.2 C42.2 U7.1 U11.1
$1N94: C21.1 C42.1 L1.1 L3.1 U7.6 U11.6
$1N259: C13.2 C25.2 U1.3 U9.3
$1N276: R2.2 R14.2 U1.15 U1.22 U1.24 U1.26 U9.15 U9.22 U9.24 U9.26
$1N288: C4.1 C14.1 U1.2 U9.2
$1N289: C4.2 C14.2 U1.1 U9.1
$1N292: C26.2 C50.2 U6.4 U15.4
$2N43: C43.2 C60.2 U19.4 U20.4
$2N107: Q1.5 Q2.5 R23.1 R24.1
$2N108: Q1.2 Q2.2 R22.1 R28.1
$2N111: D3.1 D6.1
$2N115: R11.2 R29.2 USB1.B5 USB2.B5
$2N119: R10.2 R30.2 USB1.A5 USB2.A5
$2N147: LED1.4 LED2.2 LED3.2 LED4.4
$3N7: C2.2 U8.1
$3N8: C2.1 L2.1 U8.6

Pads without a net: CN4 A16 A17 B16 B17; F1 1 2; F2 1 2; MARK1 1; MARK2 1; MARK3 1; MARK4 1; MARK5 1; MARK6 1; NOREF 1; NOREF#2 1; NOREF#3 1; NOREF#4 1; NOREF#5 1; NOREF#6 1; NOREF#7 1; NOREF#8 1; NOREF#9 1; NOREF#10 1; NOREF#11 1; U1 12 13 19 21; U9 12 13 19 21; U10 3 5; U13 3 5; U18 5; U22 5; USB1 A8 B8; USB2 A8 B8

## Via types
v1: diameter 0.61, hole 0.305, Top Layer to Bottom Layer, 260 vias

## Routing (per net, layer and track width the routed paths; a pad name or vN(x,y) marks a point on that pad's centre or on a via; arc(x,y) is an arc through that point)
+5V: length 140.3
  Inner1 w0.508: v1(71.69,12.92) 73.53,12.92 75.06,11.39 78.74,11.39 79.38,12.03 79.38,14.44 80.65,15.71 v1(81.66,15.71) ; v1(58.33,71.87) 56.49,71.87 54.97,73.39 51.28,73.39 50.65,72.76 50.65,70.34 49.38,69.07 v1(48.36,69.07)
  Inner1 w0.635: v1(68.81,77.96) 68.56,77.96 v1(68.18,77.58) 62.21,77.58 58.4,73.77 v1(58.4,70.22) 58.4,66.53 63.09,61.84 63.09,57.64 62.59,57.14 58.78,57.14 58.27,56.63 v1(58.27,55.87) ; v1(61.21,6.82) 61.47,6.82 v1(61.85,7.2) 67.82,7.2 71.63,11.01 v1(71.63,14.57) 71.63,18.25 66.93,22.95 66.93,27.14 67.44,27.65 71.25,27.65 71.75,28.16 v1(71.75,28.92)
  Bottom Layer w0.254: U6.1 69.56,29.3 68.71,29.3 68.45,29.05 68.45,27.52 68.64,27.33 U6.3 71.63,27.33 ; 58.4,57.45 U15.3 61.38,57.45 61.57,57.26 61.57,55.74 61.32,55.49 60.46,55.49 U15.1
  Bottom Layer w0.508: U20.3 55.66,70.03 55.47,70.22 55.47,71.61 55.79,71.93 U20.1 ; 80.39,16.98 80.39,16.14 80.82,15.71 v1(81.66,15.71) ; U19.1 74.23,12.86 74.55,13.17 74.55,14.57 74.36,14.76 U19.3 ; 49.63,67.81 49.63,68.65 49.2,69.07 v1(48.36,69.07)
  Bottom Layer w0.635: v1(58.33,71.87) 56.71,71.87 U20.1 ; v1(58.33,71.87) 58.14,72.06 U17.3 ; v1(58.33,71.87) 58.4,71.8 v1(58.4,70.22) ; C10.2 71.75,27.46 v1(71.75,28.92) ; v1(71.69,12.92) 71.88,12.73 U5.3 ; v1(71.69,12.92) 71.63,12.98 v1(71.63,14.57) ; v1(71.69,12.92) 73.31,12.92 U19.1 ; v1(58.27,55.87) 58.27,57.33 C58.2 ; 80.39,17.11 80.39,16.98 ; 49.63,67.68 49.63,67.81
AVCC: length 49.7
  Bottom Layer w0.254: C17.2 62.55,29.37 R3.2 C24.2 63.75,28.98 63.75,28.41 64.01,28.16 66.68,28.16 67.03,28.51 U6.5 ; C17.2 62.61,31.27 62.61,32.22 63,32.61 U4.6 ; C17.2 63.45,31.21 64.34,30.32 66.76,30.32 ; 63.26,54.47 59.41,54.47 59.09,54.15 59.09,52.88 58.64,52.43 U16.6 ; 63.26,54.47 63.28,54.44 C52.2 63.28,52.63 62.86,52.2 U14.6 ; 63.26,54.47 65.68,54.47 66.57,53.58 C44.2 ; 66.76,30.32 70.61,30.32 70.93,30.64 70.93,31.91 71.38,32.35 U2.6 ; 66.76,30.32 66.74,30.34 C16.2 66.74,32.16 67.16,32.58 U3.6 ; C44.2 67.41,53.52 67.41,52.56 67.03,52.18 U12.6 ; C44.2 67.47,55.41 R15.2 C51.2 66.27,55.8 66.27,56.37 66.02,56.63 63.35,56.63 63,56.28 U15.5
GND: length 41.4
  Top Layer w0.254: U8.2 32.26,12.22 v1(32.26,13.13)
  Bottom Layer w0.254: v1(53.65,39.03) 56.51,41.9 v1(56.51,42.38) 56.51,42.64 56.1,43.05 arc(56.03,43.15) 55.93,43.22 53.52,45.63 v1(53.52,45.76)
  Bottom Layer w0.381: U1.28 54.61,17.78 53.94,18.45 53.94,21.06 53.5,21.5 U1.29 ; U9.29 77.52,62.29 78.05,61.76 78.05,59.02 78.5,58.56 U9.14 ; U9.29 76.52,63.29 76.09,63.72 76.09,66.34 75.41,67.01 U9.28 ; U9.29 76.05,61.81 U9.20 ; U1.29 52.5,22.5 51.97,23.03 51.97,25.77 51.52,26.23 U1.14 ; U1.29 53.97,22.98 U1.20
  vias: v1(9.65,10.63) v1(23.53,16.18) v1(24.95,16.18) v1(26.55,16.09) v1(28.7,15.71) v1(32.36,19.56) v1(34,19.56) v1(34.04,13.55) v1(35.18,18.25) v1(37.21,12.41) v1(37.34,10.25) v1(44.53,26.13) v1(44.53,23.2) v1(44.53,20.79) v1(44.7,18) v1(45.9,61) v1(45.9,58.46) v1(45.9,53.38) v1(46.03,33.95) v1(46.03,26.33) v1(46.35,17.62) v1(46.86,26) v1(47.88,9.74) v1(48.44,76.24) v1(48.44,73.7) v1(48.44,63.54) v1(48.44,50.84) v1(48.56,33.95) v1(50.5,30.8) v1(50.98,53.38) v1(51.1,31.41) v1(52.08,68.09) v1(52.79,61.19) v1(53.52,78.78) v1(53.52,53.38) v1(53.65,6.01) v1(53.84,70.98) v1(54.33,51.55) v1(54.56,31.74) v1(54.84,48.88) v1(54.99,35.78) v1(54.99,34.76) v1(54.99,12.65) v1(55.22,68.44) v1(55.98,68.19) v1(56.06,78.78) v1(56.06,76.24) v1(56.06,73.7) v1(56.19,3.47) v1(56.26,35.65) v1(56.86,12.3) v1(57.51,70.98) v1(57.48,63.23) v1(57.63,54.47) v1(59.28,56.25) v1(59.44,35.52) v1(59.5,12.98) v1(61.14,81.32) v1(61.32,61.58) v1(61.26,26.33) v1(61.44,71.49) v1(61.37,66.66) v1(61.44,53.33) v1(61.59,8.68) v1(61.95,55.1) v1(62.08,49.26) v1(62.36,21.14) v1(62.36,19.27) v1(63.63,35.52) v1(63.68,83.86) v1(63.81,21.25) v1(64.39,31.46) v1(64.77,29.55) v1(64.9,9.74) v1(65.13,75.04) v1(65.25,55.23) v1(65.63,53.33) v1(66.22,63.54) v1(66.34,0.93) v1(66.4,49.26) v1(67.67,65.52) v1(67.67,63.64) v1(67.94,35.52) v1(68.07,29.68) v1(68.43,76.11) v1(68.58,31.46) v1(68.58,13.3) v1(68.71,23.2) v1(68.66,18.12) v1(68.76,58.46) v1(68.88,3.47) v1(70.53,71.81) v1(70.59,49.26) v1(70.74,28.54) v1(72.39,30.32) v1(72.54,21.55) v1(72.52,13.81) v1(73.16,72.48) v1(73.55,42.39) v1(73.84,81.32) v1(73.76,49.14) v1(74.04,16.6) v1(73.97,11.09) v1(73.97,8.55) v1(73.97,6.01) v1(74.8,16.35) v1(75.03,72.13) v1(75.03,50.02) v1(75.03,49.01) v1(75.18,35.9) v1(75.46,53.04) v1(75.69,33.24) v1(76.19,13.81) v1(76.38,78.78) v1(76.38,45.76) v1(76.5,39.03) v1(76.5,31.41) v1(76.5,6.01) v1(77.23,23.6) v1(77.95,16.7) v1(78.92,53.38) v1(79.04,31.41) v1(79.52,53.99) v1(81.46,50.84) v1(81.59,33.95) v1(81.59,21.25) v1(81.59,11.09) v1(81.59,8.55) v1(82.15,75.04) v1(83.16,58.79) v1(83.67,67.17) v1(84,58.46) v1(84.12,33.95) v1(84.12,31.41) v1(84.12,26.33) v1(84.12,23.79) v1(84.12,11.09) v1(85.32,66.79) v1(85.5,63.99) v1(85.5,61.58) v1(85.5,58.66)
PVCC: length 69.8
  Top Layer w0.203: CN4.A18 8.16,12.41 1.84,12.41 CN4.B18
  Top Layer w0.508: CN4.A18 10.32,12.5 11.94,10.89 34.04,10.89 35.05,11.9 v1(35.05,14.82) 35.18,14.95 35.18,16.73 35.12,16.78 C29.2
  Bottom Layer w0.508: C30.1 81.57,70.53 82.15,69.96 ; v1(35.05,14.82) 47.88,14.82 48.45,14.25 C7.1
VBUS: length 25.5
  Top Layer w0.381: 77.5,22.41 76.07,23.84 76.07,27.4 76.56,27.88 76.58,27.88 arc(76.66,27.88) 76.73,27.88 77.34,27.88 ; 77.5,22.41 77.5,22.44 78.3,23.24 ; 77.5,22.41 77.82,22.1 77.82,21.08 78.61,20.28 v1(79.63,20.28) ; 51.73,61.55 52.52,62.34 52.52,62.38 ; 52.52,62.38 52.21,62.69 52.21,63.71 51.41,64.5 v1(50.4,64.5) ; 52.52,62.38 53.95,60.95 53.95,57.39 53.46,56.9 53.44,56.9 arc(53.37,56.91) 53.29,56.9 52.68,56.9
  Bottom Layer w0.381: D6.2 50.4,65.31 v1(50.4,64.5) ; D3.2 79.63,19.47 v1(79.63,20.28)
VCC: length 238.2
  Top Layer w0.254: 73.78,51.42 75.03,51.42 76.3,52.69 81.51,52.69 82.02,53.21 LED3.1 v1(83.54,53.99) ; LED1.1 46.63,16.2 v1(46.61,16.22) ; 56.25,33.36 54.99,33.36 53.72,32.09 48.51,32.09 48,31.58 LED2.1 v1(46.48,30.8) ; LED4.1 85.09,68.59 v1(85.19,68.69)
  Top Layer w0.635: 73.69,51.33 v1(71.92,51.33) 71.51,50.91 65.96,50.91 62.97,53.91 62.97,61.12 62.98,61.13 62.98,61.78 62.97,61.79 62.97,63.49 61.7,64.76 v1(61.7,65.26) ; v1(68.33,19.52) 68.33,20.03 67.06,21.3 67.06,23 67.04,23.01 67.04,23.65 67.06,23.66 67.06,30.88 64.06,33.87 58.52,33.87 v1(58.1,33.46) 56.34,33.46 U21.2
  Inner1 w0.254: v1(83.54,53.99) 83.95,53.99 85.25,55.29 arc(85.8,56.98) 86.21,58.71 arc(86.24,58.89) 86.28,59.08 arc(86.45,60.26) 86.56,61.45 arc(86.57,61.76) 86.59,62.07 arc(86.59,62.14) 86.59,62.21 arc(86.59,62.45) 86.6,62.69 arc(86.6,62.82) 86.6,62.95 arc(86.59,63.16) 86.59,63.36 arc(86.58,63.74) 86.56,64.12 arc(86.5,64.78) 86.43,65.43 arc(86.36,65.96) 86.28,66.49 arc(86.18,67) 86.08,67.5 arc(86.02,67.73) 85.97,67.96 85.23,68.69 v1(85.19,68.69) ; v1(46.48,30.8) 46.08,30.8 44.83,29.55 44.83,27.65 43.94,26.76 43.94,17.62 45.34,16.22 v1(46.61,16.22)
  Inner1 w0.635: 52.52,70.04 52.13,70.43 v1(52.13,72.63) ; 52.52,70.04 57.36,65.2 57.38,65.2 60.23,62.34 v1(60.94,62.34) ; 52.52,70.04 52.49,70.04 v1(51.09,68.64) ; v1(77.89,12.16) 77.89,14.35 77.5,14.74 ; 77.5,14.74 77.53,14.74 v1(78.93,16.14) ; 77.5,14.74 72.66,19.58 72.65,19.58 69.79,22.44 v1(69.09,22.44)
  Bottom Layer w0.254: U18.10 58.49,59.33 58.01,59.8 58.01,61.96 58.38,62.33 U18.7 ; v1(52.13,72.63) 54.33,72.63 55.22,73.52 55.22,80.76 55.73,81.27 56.75,81.27 56.87,81.14 U17.5 ; R27.1 51.54,66.53 51.09,66.98 v1(51.09,68.64) ; v1(78.93,16.14) 78.93,17.81 78.49,18.25 R17.1 ; U5.5 73.15,3.65 73.28,3.52 74.29,3.52 74.8,4.03 74.8,11.27 75.69,12.16 v1(77.89,12.16) ; U22.10 71.53,25.46 72.01,24.98 72.01,22.82 71.64,22.46 U22.7
  Bottom Layer w0.508: C62.2 49.06,72.82 49.38,73.14 51.66,73.14 52.13,72.67 ; C40.2 80.96,11.96 80.65,11.65 78.36,11.65 77.89,12.11
  Bottom Layer w0.635: 72.43,50.15 72.43,50.82 v1(71.92,51.33) 71.96,51.33 72.43,51.8 ; 67.25,18.12 67.02,18.12 66.91,18.24 U10.1 66.91,20.58 66.57,20.92 65.79,20.92 65.63,20.77 U10.2 ; 67.25,18.12 C9.1 ; 67.25,18.12 67.25,18.44 v1(68.33,19.52) 68.58,19.78 69.14,19.78 ; 60.88,65.01 60.94,64.96 v1(60.94,62.34) 59.2,62.34 U18.7 ; 60.88,65.01 61.44,65.01 v1(61.7,65.26) 62.78,66.35 62.78,66.66 ; 60.88,65.01 C55.2 59.73,66.61 R25.1 ; 62.78,66.66 63,66.66 63.12,66.54 U13.1 63.12,64.2 63.46,63.87 64.24,63.87 64.39,64.02 U13.2 ; 62.78,66.66 C53.1 ; U19.5 77.85,12.86 C39.2 77.91,12.18 ; 57.59,34.63 57.59,33.97 v1(58.1,33.46) 58.07,33.46 57.59,32.98 ; 69.14,19.78 C41.2 70.29,18.18 R18.1 ; 69.14,19.78 69.09,19.83 v1(69.09,22.44) 70.82,22.44 U22.7 ; 52.11,72.61 C61.2 52.17,71.93 U20.5
CAN_RX: length 24.3
  Top Layer w0.254: v1(73.15,11.9) 73.15,14.57 72.52,15.2 67.44,15.2 66.93,15.71 66.93,16.83 U21.22 ; v1(56.87,72.88) 56.87,70.22 57.51,69.58 62.59,69.58 63.09,69.07 63.09,67.96 U23.22
  Bottom Layer w0.254: v1(73.15,11.9) U5.4 ; v1(56.87,72.88) U17.4
CAN_TX: length 18.6
  Top Layer w0.254: U23.21 64.39,68.95 63.9,69.44 63.49,69.44 62.71,70.22 61.06,70.22 60.68,70.6 v1(60.68,72.88) ; v1(69.34,11.9) 69.34,14.19 68.96,14.57 67.31,14.57 66.53,15.35 66.12,15.35 65.63,15.84 U21.21
  Bottom Layer w0.254: v1(60.68,72.88) U17.1 ; v1(69.34,11.9) U5.1
CANH: length 14.9
  Top Layer w0.254: v1(59.41,76.77) 59.41,76.89 58.65,77.65 58.65,78.34 58.39,78.6 ; v1(70.61,8.01) 70.61,7.9 71.37,7.14 71.37,6.44 71.63,6.18
  Bottom Layer w0.254: v1(70.61,8.01) U5.7 70.61,3 R1.2 ; v1(59.41,76.77) U17.7 59.41,81.78 R26.2
CANL: length 14.9
  Top Layer w0.254: 72.77,6.71 72.77,7.08 71.88,7.96 v1(71.37,7.96) ; v1(58.65,76.82) 58.14,76.82 57.26,77.71 CN6.2
  Bottom Layer w0.254: v1(71.37,7.96) 71.88,7.46 U5.6 71.88,3 R1.1 ; v1(58.65,76.82) 58.14,77.33 U17.6 58.14,81.78 R26.1
CH340_D+: length 20.5
  Top Layer w0.119: v1(78.99,26.81) 78.56,26.81 78.26,26.51 ; 51.76,58.28 51.96,58.47 ; 51.76,58.28 51.46,58.28 51.16,58.58 51.16,59.04 51.58,59.46 USB1.A6 ; 51.76,58.28 51.46,57.98 v1(51.03,57.98) ; 78.26,26.51 78.56,26.51 78.87,26.2 78.87,25.74 78.45,25.33 USB2.A6 ; 78.26,26.51 78.07,26.31
  Bottom Layer w0.119: U22.1 77.03,25.46 77.26,25.24 77.98,25.24 78.23,25.49 78.23,26.63 78.41,26.81 v1(78.99,26.81) ; v1(51.03,57.98) 51.62,57.98 51.79,58.15 51.79,59.3 52.04,59.55 52.77,59.55 52.99,59.33 U18.1
  Bottom Layer w0.127: 48.77,57.32 49.32,57.32 49.79,57.79 50.87,57.79 50.99,57.91 ; 81.25,27.47 80.7,27.47 80.23,26.99 79.16,26.99 D2.6
CH340_D-: length 20.4
  Top Layer w0.119: USB2.B7 78.69,24.84 78.75,24.86 arc(78.83,24.86) 78.9,24.84 79.36,24.84 v1(79.5,24.98) ; USB1.A7 52.62,58.98 52.94,59.3 52.94,59.93 52.68,60.18 52.38,60.18 52.16,59.96 ; USB2.A7 77.41,25.81 77.09,25.49 77.09,24.86 77.34,24.6 77.64,24.6 77.86,24.82 ; v1(50.52,59.8) 50.66,59.94 51.12,59.94 arc(51.2,59.92) 51.27,59.93 51.33,59.94 USB1.B7
  Bottom Layer w0.119: U22.2 77.06,24.46 77.57,24.97 79.49,24.97 v1(79.5,24.98) ; U18.2 52.96,60.33 52.46,59.82 50.54,59.82 v1(50.52,59.8)
  Bottom Layer w0.127: 48.28,59.15 49.54,59.15 50.14,59.75 50.47,59.75 v1(50.52,59.8) ; v1(79.5,24.98) 79.56,25.04 79.88,25.04 80.48,25.63 81.75,25.63
CUR_A: length 9.7
  Top Layer w0.254: U21.39 70.62,33.37 v1(70.23,32.98) ; v1(59.79,51.8) 59.41,51.42 U23.39
  Bottom Layer w0.254: U2.1 70.17,32.92 v1(70.23,32.98) ; U16.1 59.85,51.86 v1(59.79,51.8)
CUR_B: length 21.2
  Top Layer w0.254: v1(66.17,32.86) 68.58,30.44 70.93,30.44 72.59,32.1 U21.38 ; v1(63.85,51.93) 61.44,54.34 59.09,54.34 57.44,52.69 U23.38
  Bottom Layer w0.254: U14.1 65.09,51.93 v1(63.85,51.93) ; U3.1 64.93,32.86 v1(66.17,32.86)
CUR_C: length 12.4
  Top Layer w0.254: U23.4 70.58,53.96 70.24,53.61 v1(70.24,52.66) ; U21.4 59.44,30.83 59.79,31.17 v1(59.79,32.13)
  Bottom Layer w0.254: v1(59.79,32.13) 59.79,32.7 60.01,32.92 U4.1 ; v1(70.24,52.66) 70.24,52.09 70.01,51.86 U12.1
DTR: length 28.4
  Bottom Layer w0.152: U22.4 76.92,22.46 77.97,21.41 R22.2 77.34,19.78 77.22,19.65 77.22,15.98 76.95,15.71 73.66,15.71 73.14,16.23 Q2.4 ; Q1.4 56.88,68.56 56.36,69.07 53.08,69.07 52.81,68.81 52.81,65.14 52.68,65.01 R28.2 52.05,63.38 53.1,62.33 U18.4
INA: length 16.6
  Top Layer w0.254: v1(57.53,18.44) 58.17,19.07 58.17,22.7 57.65,23.21 U21.10 ; U23.10 72.37,61.58 71.86,62.09 71.86,65.71 v1(72.49,66.35)
  Bottom Layer w0.254: U1.27 57.52,18.43 v1(57.53,18.44) ; U9.27 72.51,66.36 v1(72.49,66.35)
INB: length 9.9
  Top Layer w0.254: v1(57.46,19.77) 57.46,21.81 57.28,21.99 56.3,21.99 U21.11 ; v1(72.57,65.01) 72.57,62.98 72.75,62.8 73.73,62.8 U23.11
  Bottom Layer w0.254: v1(57.46,19.77) 57.41,19.73 U1.25 ; U9.25 72.61,65.06 v1(72.57,65.01)
INC:
  vias: v1(55.9,21.03) v1(74.12,63.76)
IO0_BOOT: length 50.6
  Top Layer w0.152: v1(53.63,67.36) 54.33,66.66 56.27,66.66 U23.27 ; U21.27 73.75,18.12 75.69,18.12 v1(76.39,17.42)
  Top Layer w0.254: v1(45.44,67.93) 47.22,69.71 51.28,69.71 v1(53.63,67.36) ; v1(84.58,16.85) 82.8,15.08 78.74,15.08 v1(76.39,17.42)
  Bottom Layer w0.152: R17.2 76.33,18.25 75.55,17.47 Q2.3 ; R27.2 53.7,66.53 54.47,67.31 Q1.3
  Bottom Layer w0.254: R17.2 76.46,17.49 v1(76.39,17.42) 76.52,17.3 C38.1 ; R27.2 53.56,67.29 v1(53.63,67.36) 53.51,67.49 C59.1 ; v1(84.58,16.85) 84.58,21.06 85.34,21.82 85.34,23.59 84.39,24.54 SW6.1 ; SW1.1 45.64,60.24 44.68,61.2 44.68,62.96 45.44,63.72 v1(45.44,67.93)
IO3_DVP_VSYNC: length 63.3
  Top Layer w0.152: U21.15 58.01,15.74 57.48,15.2 44.85,15.2 42.54,17.51 42.54,26.25 42.3,26.5 CN4.A6 7.25,27.5 CN4.A5
IO5_DVP_XCLK: length 8.1
  Top Layer w0.254: U21.5 56.13,29.68 54.74,29.68 54.48,29.94 54.48,30.44 54.13,30.8 LED2.4 ; LED3.4 75.9,53.99 75.54,54.34 75.54,54.85 75.29,55.1 73.9,55.1 U23.5
IO6_DVP_D5: length 51.6
  Top Layer w0.152: CN4.A3 7.25,29.5 CN4.A4 8.26,28.49 42.89,28.49 44.21,29.81 53.97,29.81 55.49,28.29 U21.6
IO7_DVP_PCLK: length 57.3
  Top Layer w0.152: CN4.B4 2.75,28.5 CN4.B3 4.74,28.51 6.76,28.51 7.76,27.51 43.42,27.51 45.09,29.17 53.34,29.17 55.49,27.02 U21.7
IO9_DVP_D7: length 70.6
  Top Layer w0.152: CN4.B6 2.75,26.5 CN4.B5 4.74,26.51 6.73,26.51 7.75,25.49 40.77,25.49 41.28,24.98 41.28,17.17 43.75,14.7 58.88,14.7 59.51,15.33 arc(59.68,15.52) 59.87,15.68 60.56,16.37
  Top Layer w0.254: U21.17 60.56,16.07
IO10: length 69.9
  Top Layer w0.152: CN4.A7 7.25,24.5 CN4.A8 39.85,24.5 40.26,24.09 40.26,16.85 43.05,14.06 57.66,14.06 59.27,12.45 61.38,12.45 62.48,13.55 62.48,15.46 62.1,15.84 62.1,16.57 U21.18
IO11: length 69.4
  Top Layer w0.152: U21.19 63.09,13.02 61.72,11.65 54.99,11.65 54.36,12.28 42.16,12.28 38.1,16.35 38.1,21.93 37.53,22.5 CN4.A10 8.18,22.57 7.18,22.57 CN4.A9
IO12_I2S_DI: length 75.6
  Top Layer w0.152: U21.20 64.37,15.81 63.63,15.08 63.63,12.66 61.98,11.01 54.61,11.01 53.85,11.77 47.51,11.77 47.26,11.52 41.66,11.52 37.15,16.03 37.15,20.72 36.45,21.43 7.75,21.43 6.66,22.51 4.74,22.51 CN4.B9 2.75,22.5 CN4.B10
IO21_SD_DAT0: length 93.2
  Top Layer w0.152: CN4.A11 7.09,20.66 35.18,20.66 36.07,19.78 36.07,15.58 41.28,10.38 47.12,10.38 47.91,11.17 53.18,11.17 54.23,10.12 60.96,10.12 61.98,9.11 74.42,9.11 74.93,9.62 74.93,15.08 74.29,15.71 68.33,15.71 68.18,15.86 U21.23 ; 5.69,21.53 4.31,21.53
  Top Layer w0.254: 4.31,21.53 4.28,21.5 CN4.B11 ; 5.69,21.53 5.72,21.5 CN4.A11
IO35: length 15.9
  Top Layer w0.254: U23.28 53.96,65.39 51.28,68.06 49.73,68.06 CN7.1 ; U21.28 76.07,19.4 78.74,16.73 80.3,16.73 CN1.1
IO36: length 16.6
  Top Layer w0.254: CN7.2 49.47,66.79 51.54,66.79 54.21,64.12 U23.29 ; U21.29 75.81,20.67 78.49,18 80.56,18 CN1.2
IO39_LCD_DC: length 17
  Top Layer w0.254: U21.32 68.97,24.48 v1(67.82,23.33) ; v1(62.21,61.45) 61.06,60.31 U23.32
  Bottom Layer w0.254: U13.8 63.12,61.18 62.84,61.45 v1(62.21,61.45) ; U10.8 66.91,23.61 67.18,23.33 v1(67.82,23.33)
IO40_LCD_MOSI: length 19.8
  Top Layer w0.254: v1(67.94,25.49) 72.42,25.49 72.68,25.75 U21.33 ; U23.33 57.35,59.04 57.6,59.3 v1(62.08,59.3)
  Bottom Layer w0.254: v1(67.94,25.49) 67.26,26.18 65.84,26.18 65.66,26 65.66,24.71 U10.7 ; U13.7 64.37,60.08 64.37,58.79 64.19,58.61 62.77,58.61 v1(62.08,59.3)
IO41_LCD_SCK: length 22.5
  Top Layer w0.254: v1(68.2,26.63) 71.57,26.63 71.96,27.02 U21.34 ; v1(61.82,58.15) 58.45,58.15 58.07,57.77 U23.34
  Bottom Layer w0.254: U10.6 64.37,26.23 64.77,26.63 v1(68.2,26.63) ; v1(61.82,58.15) 65.25,58.15 65.66,58.56 U13.6
IO46_DVP_HREF: length 50.8
  Top Layer w0.254: v1(64.98,66.73) 65.18,66.53 70.46,66.53 70.74,66.81 U23.16 ; v1(65.04,18.06) 64.85,18.25 59.56,18.25 59.28,17.97 U21.16
  Bottom Layer w0.254: R19.2 80.91,14.94 80.52,15.33 77.09,15.33 77.08,15.34 67.05,15.34 66.54,15.84 65.91,15.84 65.04,16.71 v1(65.04,18.06) ; v1(64.98,66.73) 64.98,68.08 64.11,68.95 63.48,68.95 62.98,69.45 52.94,69.45 52.94,69.46 49.51,69.46 49.12,69.85 R31.2
LIGHTVCC: length 30
  Top Layer w0.254: C28.2 27.44,18.19 R12.2 29.03,18.24 C18.2
  Top Layer w0.508: C28.2 25.91,19.39 25.65,19.65 9.4,19.65 CN4.A12 7.25,18.5 CN4.A13 CN4.B13 2.75,18.5 CN4.B12
ME3121_FB: length 37.6
  Top Layer w0.254: v1(65.02,8.09) v1(55.88,8.09) ; v1(65,76.69) v1(74.14,76.69)
  Bottom Layer w0.254: C47.1 66.08,78.27 R21.1 R20.2 v1(65,76.69) ; v1(65.02,8.09) R6.2 R5.1 63.95,6.51 C22.1 ; v1(74.14,76.69) 74.14,74.15 73.44,73.45 U11.3 72.45,73.82 ; 57.57,10.97 U7.3 56.59,11.34 55.88,10.63 v1(55.88,8.09)
ME3121_FB2: length 10.9
  Top Layer w0.254: R12.1 30.73,16.73 R13.2 30.73,17.24 30.94,17.44 v1(31.42,17.44) ; v1(32.26,13.89) 32.94,13.89 33.19,13.64 U8.3
  Bottom Layer w0.254: v1(31.42,17.44) 31.75,17.11 31.75,14.4 v1(32.26,13.89)
NFAULT: length 6.6
  Bottom Layer w0.254: R14.1 72.24,61.33 73.06,60.51 U9.18 ; R2.1 57.78,23.46 56.97,24.28 U1.18
REF: length 44.3
  Inner1 w0.254: v1(68.68,54.85) 66.4,52.56 v1(61.95,52.56) 58.01,52.56 v1(57.51,52.06) ; v1(72.52,32.73) 72.01,32.22 v1(68.07,32.22) 63.63,32.22 v1(61.34,29.94)
  Bottom Layer w0.254: R16.2 R15.1 68.68,55.11 v1(68.68,54.85) ; U4.5 63.75,33.87 63.88,33.75 v1(63.88,32.22) ; U12.5 66.27,50.91 66.14,51.04 v1(66.14,52.56) ; v1(61.34,29.94) 61.34,29.67 R3.1 R4.2 ; U16.5 57.89,50.91 57.51,51.29 v1(57.51,52.06) ; v1(72.52,32.73) 72.52,33.49 72.14,33.87 U2.5 ; v1(68.07,32.22) 68.07,33.75 67.95,33.87 U3.5 ; U14.5 62.08,50.92 61.95,51.04 v1(61.95,52.56)
RESET: length 60.9
  Top Layer w0.254: U21.3 58.17,32.1 59.18,33.11 63.82,33.11 66.17,30.76 66.17,20.16 67.57,18.75 72.28,18.75 v1(72.34,18.81) ; U23.3 71.85,52.69 70.84,51.68 66.21,51.68 63.86,54.02 63.86,64.63 62.46,66.03 57.74,66.03 v1(57.69,65.98)
  Bottom Layer w0.152: v1(72.34,18.81) 72.34,18.72 R18.2 ; R25.2 57.69,66.07 v1(57.69,65.98)
  Bottom Layer w0.254: Q2.6 73.1,18.81 v1(72.34,18.81) ; v1(57.69,65.98) 56.92,65.98 Q1.6
RTS: length 22.4
  Bottom Layer w0.152: Q2.1 74.94,20.4 74.68,20.66 71.01,20.66 70.99,20.68 ; R23.2 70.87,16.6 70.99,16.73 70.99,20.68 ; Q1.1 55.08,64.39 55.35,64.12 59.02,64.12 59.03,64.11 ; 59.03,64.11 59.03,68.06 59.16,68.19 R24.2 ; 59.03,64.11 59.03,63.41 ; 59.79,63.41 59.84,63.36 ; 70.99,20.68 70.99,21.38 ; 70.23,21.38 70.18,21.43
SP1: length 66
  Top Layer w0.254: v1(76.94,66.79) 78.46,65.26 R33.1 ; v1(53.09,18) 51.56,19.52 R9.1
  Inner1 w0.254: v1(76.94,66.79) 75.16,65.01 75.16,59.93 66.27,51.04 62.71,51.04 61.7,50.02 v1(59.79,50.02) ; v1(70.23,34.76) 68.33,34.76 67.31,33.75 63.75,33.75 54.86,24.86 54.86,19.78 v1(53.09,18)
  Bottom Layer w0.254: U2.3 69.14,34.76 v1(70.23,34.76) ; v1(59.79,50.02) 60.88,50.02 U16.3
  vias: v1(46.99,20.74) v1(47.72,20.97) v1(82.31,63.81) v1(83.03,64.05)
SP2: length 47.8
  Top Layer w0.254: R8.1 50.87,22 51.31,22.44 51.31,23.46 52.86,25.01 53.37,25.01 v1(53.97,25.62) ; R34.1 79.16,62.79 78.72,62.34 78.72,61.33 77.17,59.78 76.66,59.78 v1(76.05,59.17)
  Inner1 w0.254: v1(64.11,50.02) 66.78,50.02 75.92,59.17 v1(76.05,59.17) ; v1(53.97,25.62) 54.1,25.62 63.25,34.76 v1(65.91,34.76)
  Bottom Layer w0.254: U3.3 64.92,34.76 v1(65.91,34.76) ; U14.3 65.1,50.02 v1(64.11,50.02)
  vias: v1(47.32,21.72) v1(48.02,21.73) v1(48.76,21.75) v1(81.26,63.04) v1(82,63.06) v1(82.7,63.06)
SP3: length 36.6
  Top Layer w0.254: v1(77.19,58.79) 78.72,60.31 R32.1 ; R7.1 51.31,24.47 v1(52.83,26)
  Inner1 w0.254: v1(61.85,34.76) 61.59,34.76 v1(52.83,26) ; v1(68.18,50.02) 68.43,50.02 v1(77.19,58.79)
  Bottom Layer w0.254: v1(61.85,34.76) 60.76,34.76 U4.3 ; U12.3 69.26,50.02 v1(68.18,50.02)
  vias: v1(47.5,24.43) v1(48.07,23.83) v1(81.95,60.96) v1(82.53,60.35)
U0RXD: length 30
  Top Layer w0.152: U21.36 v1(75.03,29.56) ; U23.36 v1(54.99,55.23)
  Bottom Layer w0.152: v1(75.03,29.56) 75.03,26.99 74.68,26.63 69.34,26.63 68.58,25.87 68.58,24.22 69.34,23.46 U22.8 ; v1(54.99,55.23) 54.99,57.8 55.35,58.15 60.68,58.15 61.44,58.91 61.44,60.57 60.68,61.33 U18.8
U0TXD: length 30.3
  Top Layer w0.152: U21.37 73.75,30.82 v1(75.18,30.82) ; U23.37 56.27,53.96 v1(54.84,53.96)
  Bottom Layer w0.152: U22.9 69.49,24.46 69.09,24.86 69.09,25.54 69.67,26.13 74.8,26.13 75.56,26.89 75.56,30.44 v1(75.18,30.82) ; v1(54.84,53.96) 54.46,54.34 54.46,57.9 55.22,58.66 60.35,58.66 60.94,59.24 60.94,59.93 60.54,60.33 U18.9
WS2812_OUTPUT: length 55.4
  Top Layer w0.152: CN4.B8 2.75,24.5 CN4.B7 4.76,24.49 6.71,24.49 7.69,23.51 38.4,23.51 39.12,22.79 39.12,16.6 42.52,13.2 LED1.2
$1N259: length 9.6
  Bottom Layer w0.254: C13.2 52.51,17.43 51.82,18.12 51.82,18.43 51.62,18.62 arc(51.43,18.7) 51.35,18.9 51.35,18.95 51.22,19.08 U1.3 ; C25.2 77.51,67.36 78.21,66.66 78.21,66.36 78.4,66.16 arc(78.6,66.08) 78.68,65.89 78.68,65.84 78.8,65.71 U9.3
$1N276: length 33.4
  Bottom Layer w0.152: U9.15 74.13,58.53 73,58.53 72.75,58.79 72.75,60.31 71.52,61.54 71.52,63.66 71.72,63.86 R14.2 ; U1.15 55.89,26.25 57.02,26.25 57.28,26 57.28,24.47 58.5,23.25 58.5,21.13 58.3,20.93 R2.2
  Bottom Layer w0.254: R14.2 71.98,64.11 71.98,65.3 72.45,65.76 74.1,65.76 U9.26 ; R14.2 72.24,63.36 72.49,63.11 U9.22 ; R14.2 72.42,63.68 72.81,63.68 73,63.87 73,64.25 73.16,64.41 U9.24 ; U1.24 56.86,20.38 57.02,20.54 57.02,20.92 57.21,21.11 57.6,21.11 R2.2 ; R2.2 58.04,20.67 58.04,19.49 57.58,19.02 55.92,19.02 U1.26 ; R2.2 57.78,21.43 57.54,21.68 U1.22
$1N288: length 7.7
  Bottom Layer w0.254: U1.2 51.15,18.43 51.46,18.11 51.46,17.11 50.87,16.51 C14.1 ; U9.2 78.88,66.36 78.56,66.68 78.56,67.68 79.16,68.27 C4.1
$1N289: length 6.3
  Bottom Layer w0.254: C14.2 49.47,16.67 48.88,17.25 48.88,17.51 49.15,17.78 U1.1 ; U9.1 80.88,67.01 81.15,67.28 81.15,67.53 80.56,68.12 C4.2
$1N292: length 3.2
  Bottom Layer w0.254: U6.4 65.78,27.33 65.53,27.58 ; 64.49,57.2 64.24,57.45 U15.4
$2N43: length 4
  Bottom Layer w0.254: C60.2 52.3,70.03 U20.4 ; U19.4 77.72,14.76 C43.2
$2N107: length 4.8
  Bottom Layer w0.152: Q1.5 57.43,66.66 57.56,66.79 57.56,67.47 R24.1 ; R23.1 72.46,17.32 72.46,18 72.59,18.12 Q2.5
$2N108: length 5.7
  Bottom Layer w0.152: Q1.2 54.46,66.66 54.33,66.53 54.33,65.39 53.95,65.01 R28.1 ; R22.1 76.07,19.78 75.69,19.39 75.69,18.25 75.56,18.12 Q2.2
$2N111: length 4.9
  Bottom Layer w0.381: D3.1 83.11,17.54 82.68,17.11 ; 47.35,67.68 46.92,67.25 D6.1
$2N115: length 4.2
  Top Layer w0.119: 77.81,27.28 77.97,27.43 78.32,27.43 v1(78.61,27.73) ; v1(51.41,57.06) 51.7,57.35 52.06,57.35 52.21,57.51
  Bottom Layer w0.119: R11.2 78.66,27.73 v1(78.61,27.73) ; R29.2 51.36,57.06 v1(51.41,57.06)
$2N119: length 5.6
  Top Layer w0.119: v1(79.63,24.09) 79.17,24.56 78.76,24.56 78.59,24.38 ; USB1.A5 51.44,60.43 ; 78.29,24.36 78.59,24.36 ; 51.44,60.41 51.26,60.23 50.86,60.23 v1(50.4,60.69)
  Bottom Layer w0.119: R30.2 49.67,60.69 v1(50.4,60.69) ; R10.2 80.36,24.09 v1(79.63,24.09)
$2N147: length 38.2
  Top Layer w0.254: LED2.2 50.52,27.8 51.44,26.89 54.23,26.89 54.86,26.25 54.86,16.73 54.36,16.22 53.02,16.22 LED1.4 ; LED4.4 77,68.57 75.67,68.57 75.16,68.06 75.16,58.53 75.79,57.9 78.59,57.9 79.5,56.99 LED3.2
$3N7: length 2.1
  Top Layer w0.254: U8.1 31.12,12.03 29.72,12.03 29.57,12.18 29.57,12.44

## Copper pours and planes (outline as drawn; the poured copper is in the pictures)
+5V on Bottom Layer: 69.16,78.22 69.16,77.61 68.84,77.36 67.79,77.36 67.79,78.6 68.18,78.6 68.56,78.22
+5V on Bottom Layer: 60.86,6.57 60.86,7.17 61.19,7.43 62.23,7.43 62.23,6.19 61.85,6.19 61.47,6.57
+5V on Bottom Layer: 63.31,1.24 62.97,0.9 58.5,0.9 58.04,1.36 58.04,2.76 58.29,3.01 60.32,3.01 60.45,2.88 60.45,2.12 60.61,1.97 61.4,1.97 61.72,2.29 61.72,3.01 61.85,3.14 61.85,5.68 61.86,5.69 61.86,7.2 63.25,7.2 63.31,7.14
+5V on Bottom Layer: 66.72,83.54 67.06,83.88 71.53,83.88 71.99,83.43 71.99,82.03 71.73,81.77 69.7,81.77 69.57,81.9 69.57,82.66 69.42,82.82 68.63,82.82 68.3,82.49 68.3,81.77 68.18,81.65 68.18,79.11 68.16,79.1 68.16,77.58 66.78,77.58 66.72,77.64
GND on Top Layer: -3.3,89.24 101.73,89.24 101.73,-1.69 -3.3,-1.69
GND on Bottom Layer: -8.89,96.36 109.6,96.36 109.6,-5.62 -8.89,-5.62
GND on Inner1: -5.33,93.31 103.76,93.31 103.76,-3.34 -5.33,-3.34
GND on Inner2: 58.09,77.21 59.97,77.21 59.97,76.39 58.09,76.39
GND on Inner2: 8.02,15.52 8.48,15.52 8.48,11.48 8.02,11.48
GND on Inner2: 67.69,78.27 69.29,78.27 69.29,77.28 67.69,77.28
GND on Inner2: 46.52,24.84 49.32,24.84 49.32,20.43 46.52,20.43
GND on Inner2: 70.05,8.4 71.93,8.4 71.93,7.58 70.05,7.58
GND on Inner2: 60.73,7.5 62.33,7.5 62.33,6.52 60.73,6.52
GND on Inner2: 0.26,84.53 99.74,84.53 99.74,5.05 0.26,5.05
GND on Inner2: 80.7,64.36 83.51,64.36 83.51,59.94 80.7,59.94
GND on Inner2: 1.5,30.52 8.5,30.52 8.5,18.34 1.5,18.34
PVCC on Top Layer: 33.62,14.28 32.04,14.28 31.88,14.44 31.88,17.11 32,17.24 34.42,17.24 34.63,17.02 34.63,16.4 33.79,15.56 33.79,14.45
PVCC on Bottom Layer: 67.44,13.93 67.44,12.78 66.17,11.51 64.78,11.51 62.48,13.81 58.99,14.71 56.03,14.71 55.42,15.11 55.41,16.45 56.02,17.06 57.37,17.06 58.45,18.14 58.45,23.24 57.15,24.54 57.15,26.48 56.61,27.01 49.78,27.01 49.4,27.4 49.4,28.92 49.78,29.3 58.71,29.3 59,29.01 58.99,27.42 61.59,24.81 61.59,18.76 64.77,15.58 65.79,15.58
PVCC on Bottom Layer: 56.9,29.11 56.84,29.05 54.61,29.05 54.61,29.14 55.17,29.7 55.17,30.19 56.39,30.19 56.39,29.62
PVCC on Bottom Layer: 50.82,24.6 51.03,24.6 51.03,24.07 48.61,24.07 47.37,25.26 47.37,28.92 47.75,29.3 49.81,29.3 49.86,29.25 49.53,28.92 49.55,28.9 49.55,27.28 48.82,26.82 48.82,24.89 49.12,24.59 50.81,24.59
PVCC on Bottom Layer: 59.94,10.12 59.94,11.69 60.1,11.84 61.26,11.84 61.41,11.68 61.41,10.9 61.89,10.54 62.65,10.54 62.95,10.68 63.23,10.96 63.23,11.94 63.96,12.66 64.13,12.66 65.09,11.71 65.09,11.44 63.12,9.48 62.89,9.23 62.1,9.23 61.34,10 60.07,10
PVCC on Bottom Layer: 79.21,60.18 79,60.18 78.99,60.72 81.42,60.72 82.65,59.53 82.65,55.87 82.27,55.49 80.21,55.49 80.16,55.53 80.49,55.87 80.48,55.88 80.48,57.51 81.2,57.97 81.2,59.89 80.9,60.19 79.21,60.19
PVCC on Bottom Layer: 73.12,55.68 73.19,55.74 75.41,55.74 75.41,55.64 74.85,55.08 74.85,54.6 73.64,54.6 73.64,55.16
PVCC on Bottom Layer: 62.59,70.85 62.59,72 63.86,73.27 65.25,73.27 67.54,70.98 71.03,70.08 73.99,70.08 74.61,69.68 74.61,68.33 74,67.72 72.65,67.72 71.58,66.65 71.57,61.55 72.87,60.25 72.87,58.31 73.41,57.77 80.24,57.77 80.62,57.39 80.62,55.87 80.24,55.49 71.31,55.49 71.02,55.78 71.03,57.37 68.43,59.97 68.43,66.03 65.25,69.2 64.24,69.2
PVCC on Bottom Layer: 74.02,67.76 72.91,68.87 72.91,70.43 73.71,71.23 74.98,71.23 76.12,72.38 81.89,72.38 82.45,71.81 82.47,65.55 81.85,64.84 78.97,64.85 78.97,65.26 79.16,65.45 81.24,65.45 81.45,65.55 81.46,69.64 81,70.09 77.13,70.12 76.72,69.71 76.72,67.76
PVCC on Bottom Layer: 56,17.02 57.11,15.91 57.11,14.35 56.31,13.55 55.05,13.55 53.91,12.41 48.13,12.41 47.57,12.97 47.55,19.23 48.17,19.94 51.06,19.94 51.05,19.52 50.87,19.33 48.78,19.33 48.58,19.23 48.57,15.15 49.02,14.7 52.9,14.67 53.31,15.08 53.31,17.02
PVCC on Bottom Layer: 70.08,74.66 70.08,73.1 69.93,72.95 68.77,72.95 68.61,73.1 68.61,73.89 68.14,74.24 67.38,74.24 67.07,74.11 66.79,73.83 66.79,72.85 66.06,72.12 65.89,72.12 64.94,73.07 64.94,73.34 66.91,75.31 67.13,75.55 67.92,75.55 68.68,74.79 69.95,74.79
PVCC on Bottom Layer: 66.11,74.32 66.14,74.29 66.14,70.73 63.9,70.73 62.29,72.33 62.29,76.06 64.37,76.06 64.37,75.03 65.07,74.32
PVCC on Bottom Layer: 63.91,10.47 63.88,10.5 63.88,14.06 66.13,14.06 67.74,12.45 67.74,8.73 65.66,8.73 65.66,9.76 64.95,10.47
LIGHTVCC on Top Layer: 23.11,14.7 24.64,14.7 24.77,14.57 24.77,12.41 24.64,12.28 23.11,12.28 23.11,12.28 21.72,12.28 21.46,12.54 21.46,18.38 21.84,18.76 26.29,18.76 26.42,18.63 26.42,17.74 26.29,17.62 23.53,17.62 22.99,17.08 22.99,14.82
OUT1 on Bottom Layer: 82.6,65.57 82.6,66.3 84.82,66.3 85.21,65.9 85.21,64.72 84.79,64.3 83.88,64.3 83.3,64.77 82.69,64.77 82.12,64.19 79.02,64.18 78.97,64.23 78.97,64.63 79.03,64.69 81.81,64.7
OUT1 on Bottom Layer: 47.43,19.22 47.43,18.48 45.21,18.49 44.81,18.88 44.81,20.07 45.24,20.48 46.14,20.48 46.73,20.02 47.33,20.02 47.9,20.6 51.01,20.61 51.05,20.56 51.05,20.16 50.99,20.09 48.22,20.09
OUT2 on Bottom Layer: 79.05,62.14 78.97,62.22 78.97,62.82 79.45,62.82 79.48,62.85 80.99,62.85 81.24,62.6 82.91,62.6 83.03,62.72 83.03,63.49 83.41,63.87 84.69,63.87 85.19,63.36 85.19,62.34 84.56,61.71 83.87,61.71 83.44,62.14
OUT2 on Bottom Layer: 50.97,22.65 51.05,22.57 51.05,21.97 50.58,21.97 50.55,21.93 49.04,21.93 48.78,22.19 47.12,22.19 46.99,22.06 46.99,21.3 46.61,20.92 45.34,20.92 44.83,21.43 44.83,22.44 45.47,23.08 46.15,23.08 46.58,22.65
OUT3 on Bottom Layer: 78.97,62.05 78.99,62.07 79.02,62.04 82.97,62.02 83.76,61.23 84.68,61.23 85.19,60.72 85.19,59.42 84.54,59.1 83.76,59.1 83.03,59.82 83.04,60.86 82.36,61.55 79.17,61.55 78.97,61.71
OUT3 on Bottom Layer: 51.05,22.73 51.04,22.71 51,22.75 47.05,22.76 46.26,23.56 45.34,23.55 44.83,24.06 44.83,25.36 45.48,25.69 46.26,25.69 46.99,24.96 46.98,23.92 47.66,23.24 50.85,23.23 51.05,23.08
SP1 on Top Layer: 83.39,64.05 82.83,63.49 82.12,63.49 81.68,63.92 81.68,64.33 81.64,64.38 80.49,64.38 80.37,64.5 80.37,66.03 80.49,66.15 82.53,66.15 82.91,65.77 82.91,64.63 83.39,64.15
SP1 on Top Layer: 46.63,20.74 47.2,21.3 47.91,21.3 48.34,20.86 48.34,20.45 48.39,20.41 49.53,20.41 49.66,20.28 49.66,18.76 49.53,18.63 47.5,18.63 47.12,19.01 47.12,20.16 46.63,20.64
SP1 on Bottom Layer: 49.28,20.61 47.86,20.61 47.32,20.08 46.67,20.08 46.44,20.31 46.44,21.02 46.75,21.23 50.93,21.25 51.05,21.17 51.05,20.92 50.8,20.62
SP1 on Bottom Layer: 80.74,64.17 82.16,64.17 82.7,64.7 83.36,64.7 83.58,64.47 83.59,63.77 83.28,63.56 79.09,63.53 78.97,63.61 78.97,63.87 79.23,64.17
SP2 on Top Layer: 80.45,61.71 80.22,61.95 80.22,63.84 80.24,63.87 81.51,63.87 81.94,63.43 82.71,63.43 83.03,63.11 83.03,61.96 82.78,61.71
SP2 on Top Layer: 49.57,23.08 49.81,22.84 49.81,20.94 49.78,20.92 48.51,20.92 48.08,21.35 47.32,21.35 46.99,21.68 46.99,22.82 47.24,23.08
SP2 on Bottom Layer: 49.55,21.25 49.63,21.17 49.91,21.17 49.89,21.15 48.28,21.15 46.87,21.26 46.95,21.9 47.74,21.97 48.57,21.97 50.9,21.97 51.05,21.81 51.05,21.59 50.72,21.25
SP2 on Bottom Layer: 80.47,63.54 80.4,63.61 80.11,63.61 80.14,63.64 81.74,63.64 83.15,63.53 83.07,62.89 82.29,62.82 81.45,62.81 79.13,62.82 78.97,62.98 78.97,63.2 79.31,63.54
SP3 on Top Layer: 82.78,59.93 82.08,59.23 80.47,59.23 80.22,59.48 80.22,61.3 80.37,61.45 82.02,61.45 82.78,60.69
SP3 on Top Layer: 47.24,24.86 47.94,25.55 49.56,25.55 49.81,25.3 49.81,23.48 49.66,23.33 48.01,23.33 47.24,24.09
